# EAGLE design SensorRevB (EAGLE 9.2.2)
Assembly variants: A, B

## Sheet 1 of 4
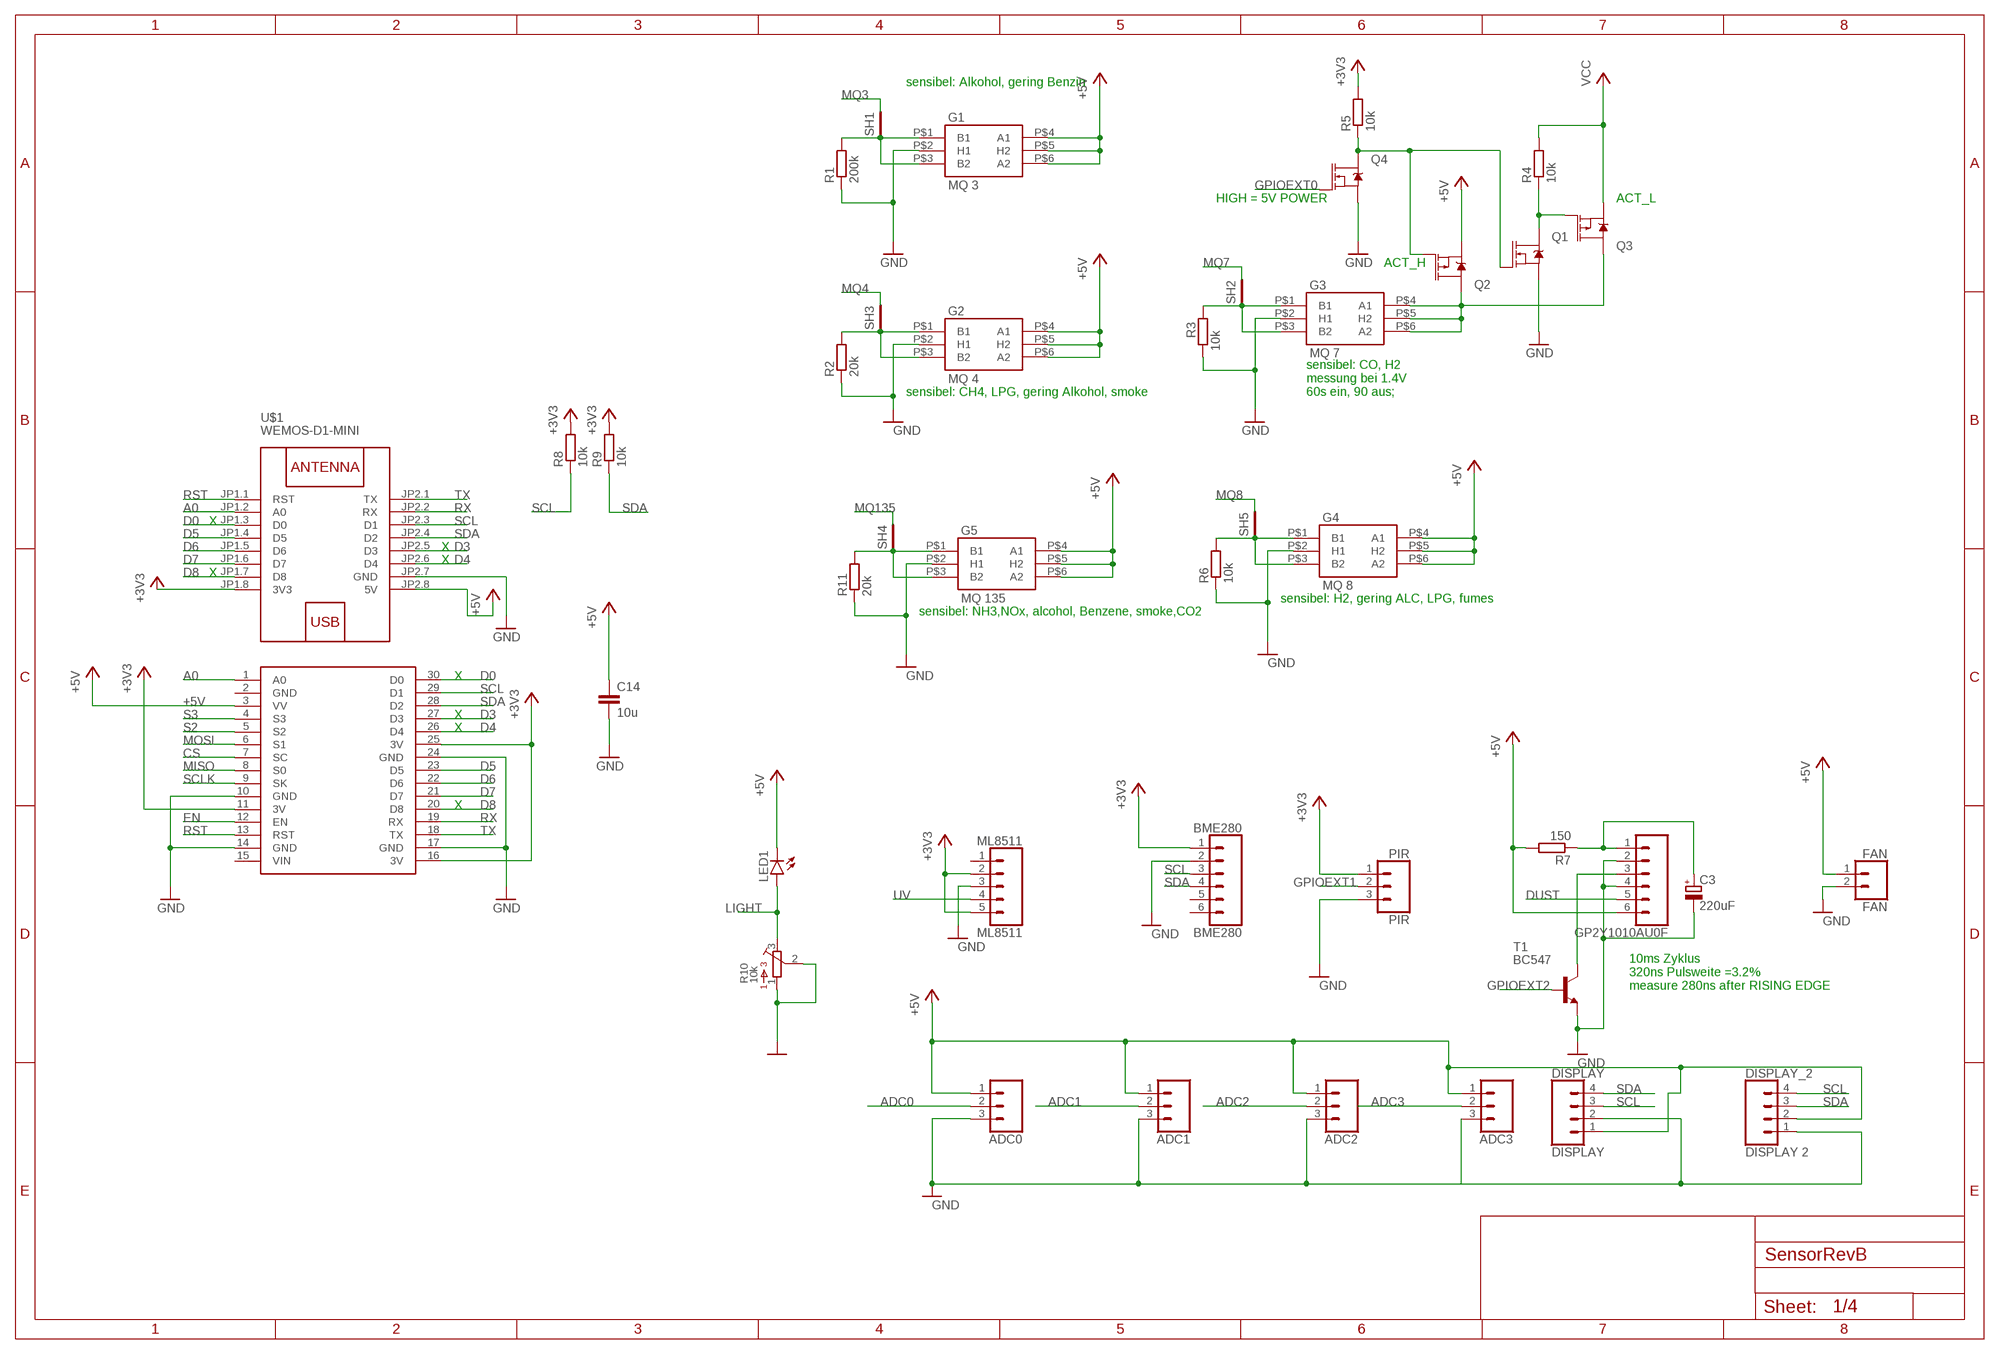
[diagram p0: schematic, sheet 1]

### Parts
ADC0  CONN_03  [1X03]
ADC1  CONN_03  [1X03]
ADC2  CONN_03  [1X03]
ADC3  CONN_03  [1X03]
BME280  BME280  CONN_06SILK_FEMALE_PTH  [1X06]
C3  220uF  CPOL-EUE2-5  [E2-5]
C14  10u  C-EUC0603  [C0603]
DISPLAY  DISPLAY  CONN_04  [1X04]
DISPLAY_2  DISPLAY 2  CONN_04  [1X04]
FAN  FAN  CONN_02LOCK  [1X02_LOCK]
G1  MQ 3  GAS_SOCKET  [GAS_SOCKET]
G2  MQ 4  GAS_SOCKET  [GAS_SOCKET]
G3  MQ 7  GAS_SOCKET  [GAS_SOCKET]
G4  MQ 8  GAS_SOCKET  [GAS_SOCKET]
G5  MQ 135  GAS_SOCKET  [GAS_SOCKET]
GP2Y1010AU0F  CONN_06SILK_FEMALE_PTH  [1X06]
LED1  LED5MM  [LED5MM]
ML8511  ML8511  CONN_05  [1X05]
PIR  PIR  CONN_03LOCK  [1X03_LOCK]
Q1  5.8A/30V/35mΩ  MOSFET-NCH-AO3404A  [SOT23-3]
Q2  4.3A/20V/54mΩ  MOSFET_PCH-IRLML2244  [SOT23-3]
Q3  4.3A/20V/54mΩ  MOSFET_PCH-IRLML2244  [SOT23-3]
Q4  5.8A/30V/35mΩ  MOSFET-NCH-AO3404A  [SOT23-3]
R1  200k  R-EU_R0805  [R0805]
R2  20k  R-EU_R0805  [R0805]
R3  10k  R-EU_R0805  [R0805]
R4  10k  R-EU_R0805  [R0805]
R5  10k  R-EU_R0805  [R0805]
R6  10k  R-EU_R0805  [R0805]
R7  150  R-EU_R0805  [R0805]
R8  10k  R-EU_R0805  [R0805]
R9  10k  R-EU_R0805  [R0805]
R10  10k  3362P  [3362P]
R11  20k  R-EU_R0805  [R0805]
SH1  SHORT-HT5  [SHORT_TOP-50]
SH2  SHORT-HT5  [SHORT_TOP-50]
SH3  SHORT-HT5  [SHORT_TOP-50]
SH4  SHORT-HT5  [SHORT_TOP-50]
SH5  SHORT-HT5  [SHORT_TOP-50]
T1  BC547  [TO92]
U$1  WEMOS-D1-MINI  [WEMOS-D1-MINI]
U$2  NODEMCU  [NODEMCU]  (not fitted in variant A)

### Nets
+3V3: BME280.1 ML8511.2 ML8511.5 PIR.1 R5.2 R8.2 R9.2 U$1.JP1.8(3V3) U$2.11(3V) U$2.16(3V) U$2.25(3V)
+5V [power]: ADC0.1 ADC1.1 ADC2.1 ADC3.1 C14.1 DISPLAY.1 DISPLAY_2.2 FAN.1 G1.P$4(A1) G1.P$5(H2) G1.P$6(A2) G2.P$4(A1) G2.P$5(H2) G2.P$6(A2) G4.P$4(A1) G4.P$5(H2) G4.P$6(A2) G5.P$4(A1) G5.P$5(H2) G5.P$6(A2) GP2Y1010AU0F.6 LED1.K(C) Q2.2(S) R7.2 U$1.JP2.8(5V) U$2.3(VV) ; also sheet 2,3
A0: U$1.JP1.2(A0) U$2.1(A0)
ADC0: ADC0.2 ; also sheet 2
ADC1: ADC1.2 ; also sheet 2
ADC2: ADC2.2 ; also sheet 2
ADC3: ADC3.2 ; also sheet 2
CS: U$2.7(SC)
D0: U$1.JP1.3(D0) U$2.30(D0)
D3: U$1.JP2.5(D3) U$2.27(D3)
D4: U$1.JP2.6(D4) U$2.26(D4)
D5: U$1.JP1.4(D5) U$2.23(D5) ; also sheet 2
D6: U$1.JP1.5(D6) U$2.22(D6)
D7: U$1.JP1.6(D7) U$2.21(D7)
D8: U$1.JP1.7(D8) U$2.20(D8)
DUST: GP2Y1010AU0F.5 ; also sheet 2
EN: U$2.12(EN)
GND [power]: ADC0.3 ADC1.3 ADC2.3 ADC3.3 BME280.2 C3.- C14.2 DISPLAY.2 DISPLAY_2.1 FAN.2 G1.P$2(H1) G2.P$2(H1) G3.P$2(H1) G4.P$2(H1) G5.P$2(H1) GP2Y1010AU0F.2 GP2Y1010AU0F.4 ML8511.3 PIR.3 Q1.2(S) Q4.2(S) R1.1 R2.1 R3.1 R6.1 R10.1 R10.2 R11.1 T1.1(E) U$1.JP2.7(GND) U$2.10(GND) U$2.14(GND) U$2.17(GND) U$2.24(GND) ; also sheet 2,3,4
GPIOEXT0: Q4.1(G) ; also sheet 2
GPIOEXT1: PIR.2 ; also sheet 2
GPIOEXT2: T1.2(B) ; also sheet 2
LIGHT: LED1.A R10.3 ; also sheet 2
MISO: U$2.8(S0)
MOSI: U$2.6(S1)
MQ3: SH1.2 ; also sheet 2
MQ4: SH3.2 ; also sheet 2
MQ7: SH2.2 ; also sheet 2
MQ8: SH5.2 ; also sheet 2
MQ135: SH4.2 ; also sheet 2
N$2: C3.+ GP2Y1010AU0F.1 R7.1
N$3: GP2Y1010AU0F.3 T1.3(C)
N$4: Q1.3(D) Q3.1(G) R4.1
N$5: Q1.1(G) Q2.1(G) Q4.3(D) R5.1
N$6 [power]: G1.P$1(B1) G1.P$3(B2) R1.2 SH1.1
N$12 [power]: G3.P$4(A1) G3.P$5(H2) G3.P$6(A2) Q2.3(D) Q3.3(D)
N$16 [power]: G3.P$1(B1) G3.P$3(B2) R3.2 SH2.1
N$17 [power]: G2.P$1(B1) G2.P$3(B2) R2.2 SH3.1
N$21 [power]: G5.P$1(B1) G5.P$3(B2) R11.2 SH4.1
N$22 [power]: G4.P$1(B1) G4.P$3(B2) R6.2 SH5.1
RST: U$1.JP1.1(RST) U$2.13(RST)
RX: U$1.JP2.2(RX) U$2.19(RX)
S2: U$2.5(S2)
S3: U$2.4(S3)
SCL: BME280.3 DISPLAY.3 DISPLAY_2.4 R8.1 U$1.JP2.3(D1) U$2.29(D1) ; also sheet 2
SCLK: U$2.9(SK)
SDA: BME280.4 DISPLAY.4 DISPLAY_2.3 R9.1 U$1.JP2.4(D2) U$2.28(D2) ; also sheet 2
TX: U$1.JP2.1(TX) U$2.18(TX)
UV: ML8511.4 ; also sheet 2
VCC [power]: Q3.2(S) R4.2 ; also sheet 3
Unconnected: BME280.5 BME280.6 ML8511.1 U$2.15(VIN)

### Notes on the sheet
- sensibel: Alkohol, gering Benzin
- HIGH = 5V POWER | ACT_L
- ACT_H
- sensibel: CH4, LPG, gering Alkohol, smoke
- sensibel: CO, H2
  messung bei 1.4V
  60s ein, 90 aus;
- X
- X
- X
- X
- sensibel: H2, gering ALC, LPG, fumes
- sensibel: NH3,NOx, alcohol, Benzene, smoke,CO2
- X
- X
- X
- X
- 10ms Zyklus
  320ns Pulsweite =3.2%
  measure 280ns after RISING EDGE

## Sheet 2 of 4: PORTEXP MUX ADC
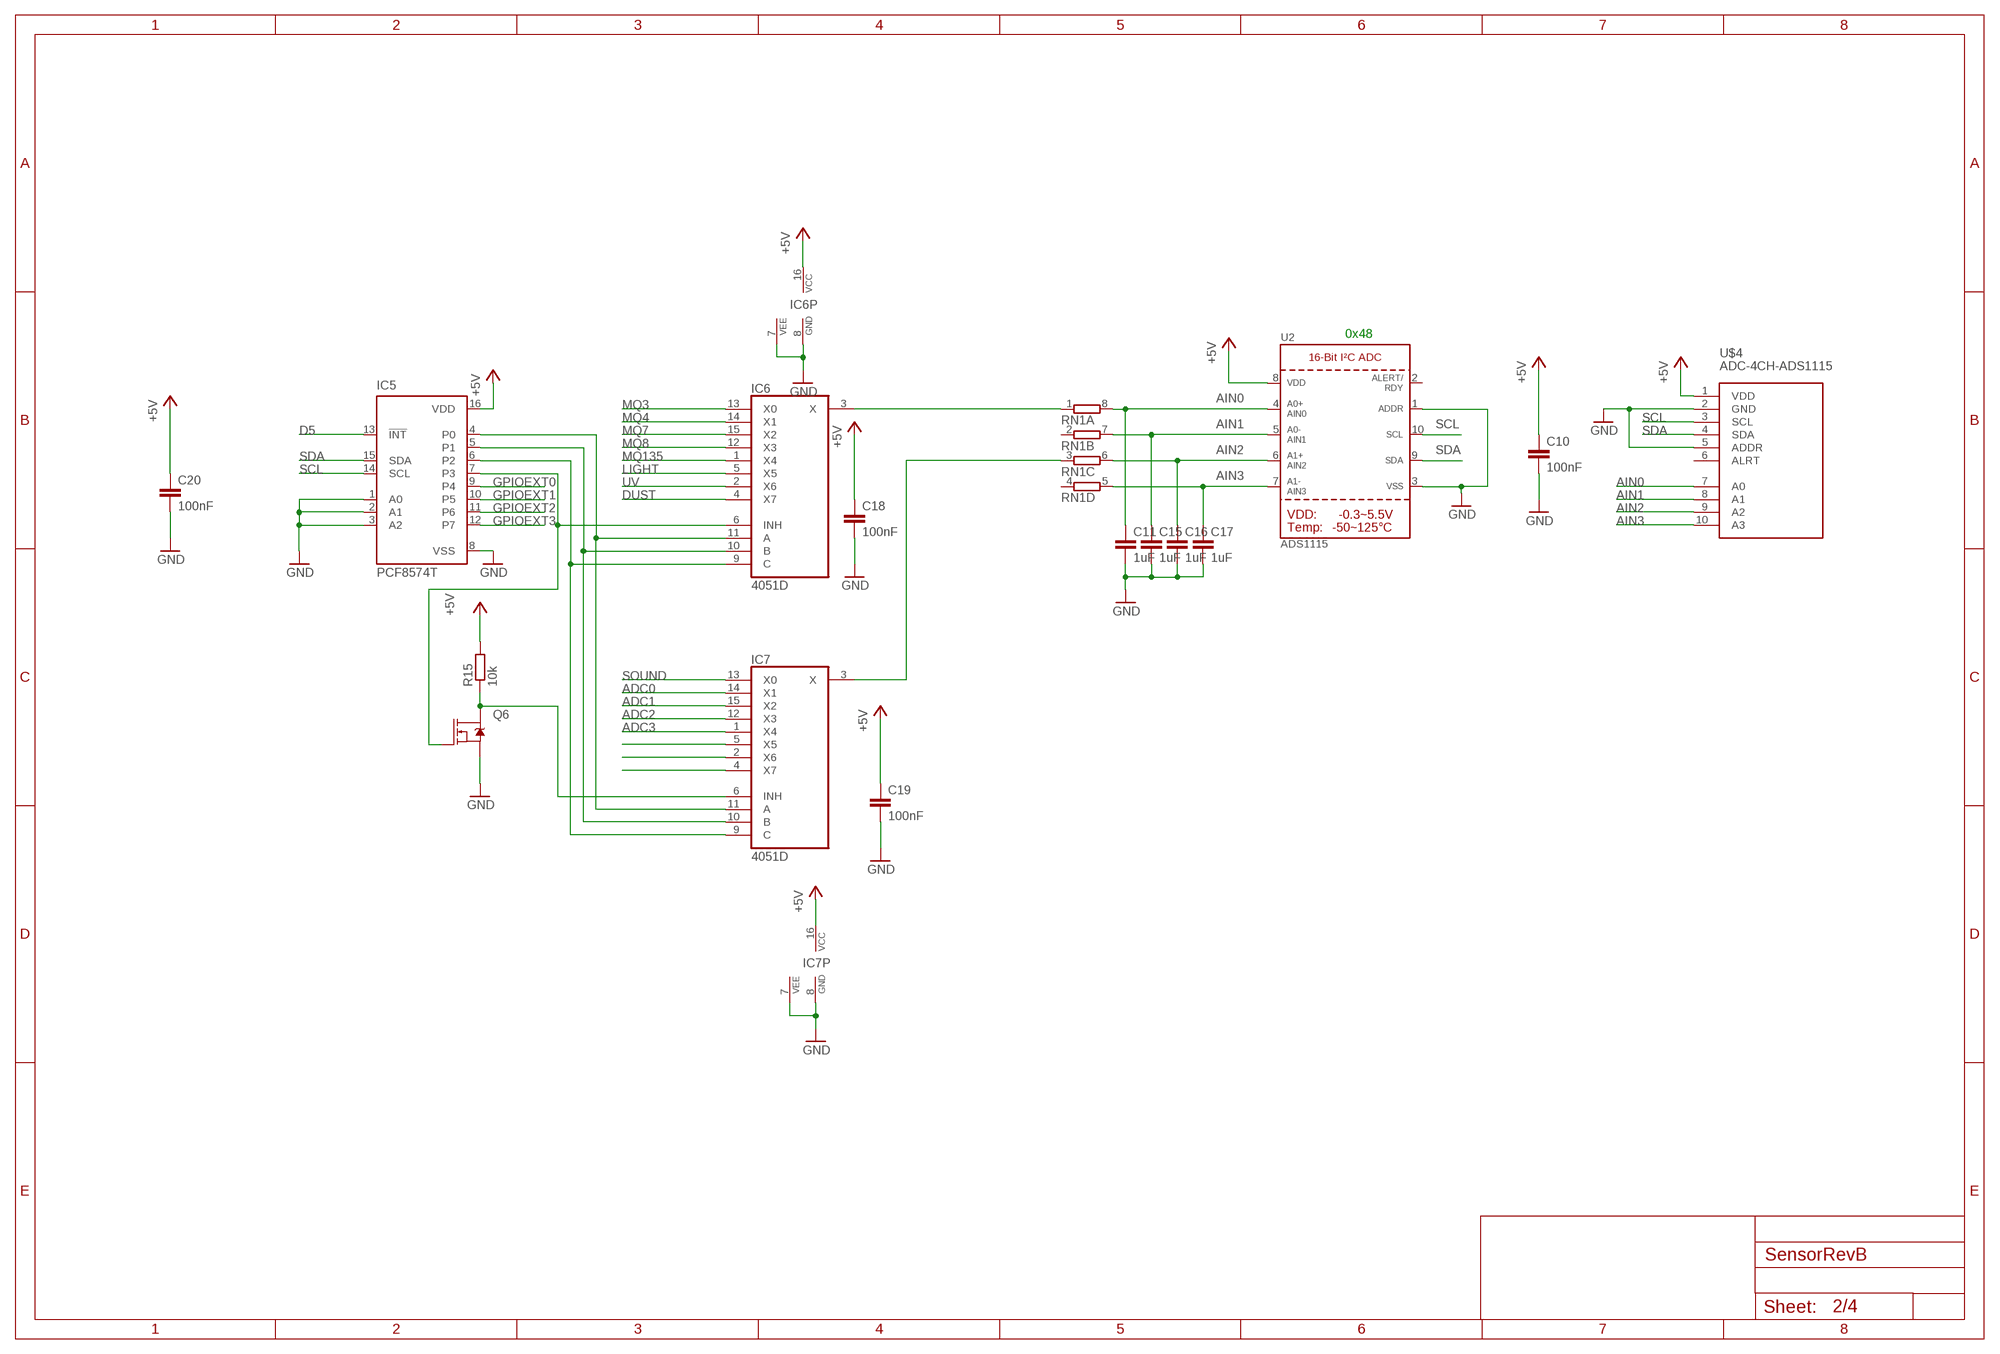
[diagram p1: schematic, sheet 2]

### Parts
C10  100nF  C-EUC0603  [C0603]
C11  1uF  C-EUC0603  [C0603]
C15  1uF  C-EUC0603  [C0603]
C16  1uF  C-EUC0603  [C0603]
C17  1uF  C-EUC0603  [C0603]
C18  100nF  C-EUC0603  [C0603]
C19  100nF  C-EUC0603  [C0603]
C20  100nF  C-EUC0603  [C0603]
IC5  PCF8574T  [SO16W]
IC6  4051D  [SO16]
IC7  4051D  [SO16]
Q6  5.8A/30V/35mΩ  MOSFET-NCH-AO3404A  [SOT23-3]
R15  10k  R-EU_R0805  [R0805]
RN1  4R-N0603-ARC  [0603-ARC]
U2  ADS1115  [MSOP10]
U$4  ADC-4CH-ADS1115  [ADC-4CH-ADS1115]  (not fitted in variant A)

### Nets
+5V [power]: C10.1 C18.1 C19.1 C20.1 IC5.16(VDD) IC6.16(VCC) IC7.16(VCC) R15.2 U2.8(VDD) U$4.1(VDD) ; also sheet 1,3
ADC0: IC7.14(X1) ; also sheet 1
ADC1: IC7.15(X2) ; also sheet 1
ADC2: IC7.12(X3) ; also sheet 1
ADC3: IC7.1(X4) ; also sheet 1
AIN0: C11.1 RN1.8 U2.4(AIN0) U$4.7(A0)
AIN1: C15.1 RN1.7 U2.5(AIN1) U$4.8(A1)
AIN2: C16.1 RN1.6 U2.6(AIN2) U$4.9(A2)
AIN3: C17.1 RN1.5 U2.7(AIN3) U$4.10(A3)
D5: IC5.13(!INT) ; also sheet 1
DUST: IC6.4(X7) ; also sheet 1
GND [power]: C10.2 C11.2 C15.2 C16.2 C17.2 C18.2 C19.2 C20.2 IC5.1(A0) IC5.2(A1) IC5.3(A2) IC5.8(VSS) IC6.7(VEE) IC6.8(GND) IC7.7(VEE) IC7.8(GND) Q6.2(S) U2.1(ADDR) U2.3(VSS) U$4.2(GND) U$4.5(ADDR) ; also sheet 1,3,4
GPIOEXT0: IC5.9(P4) ; also sheet 1
GPIOEXT1: IC5.10(P5) ; also sheet 1
GPIOEXT2: IC5.11(P6) ; also sheet 1
GPIOEXT3: IC5.12(P7)
LIGHT: IC6.5(X5) ; also sheet 1
MQ3: IC6.13(X0) ; also sheet 1
MQ4: IC6.14(X1) ; also sheet 1
MQ7: IC6.15(X2) ; also sheet 1
MQ8: IC6.12(X3) ; also sheet 1
MQ135: IC6.1(X4) ; also sheet 1
N$18: IC5.4(P0) IC6.11(A) IC7.11(A)
N$19: IC5.5(P1) IC6.10(B) IC7.10(B)
N$20: IC5.6(P2) IC6.9(C) IC7.9(C)
N$32: IC5.7(P3) IC6.6(INH) Q6.1(G)
N$33: IC7.6(INH) Q6.3(D) R15.1
N$34: IC6.3(X) RN1.1
N$35: IC7.3(X) RN1.3
N$44: IC7.5(X5)
N$45: IC7.2(X6)
N$46: IC7.4(X7)
SCL: IC5.14(SCL) U2.10(SCL) U$4.3(SCL) ; also sheet 1
SDA: IC5.15(SDA) U2.9(SDA) U$4.4(SDA) ; also sheet 1
SOUND: IC7.13(X0) ; also sheet 4
UV: IC6.2(X6) ; also sheet 1
Unconnected: RN1.2 RN1.4 U2.2(ALERT/RDY) U$4.6(ALRT)

### Notes on the sheet
- 0x48

## Sheet 3 of 4: Voltage Regulation
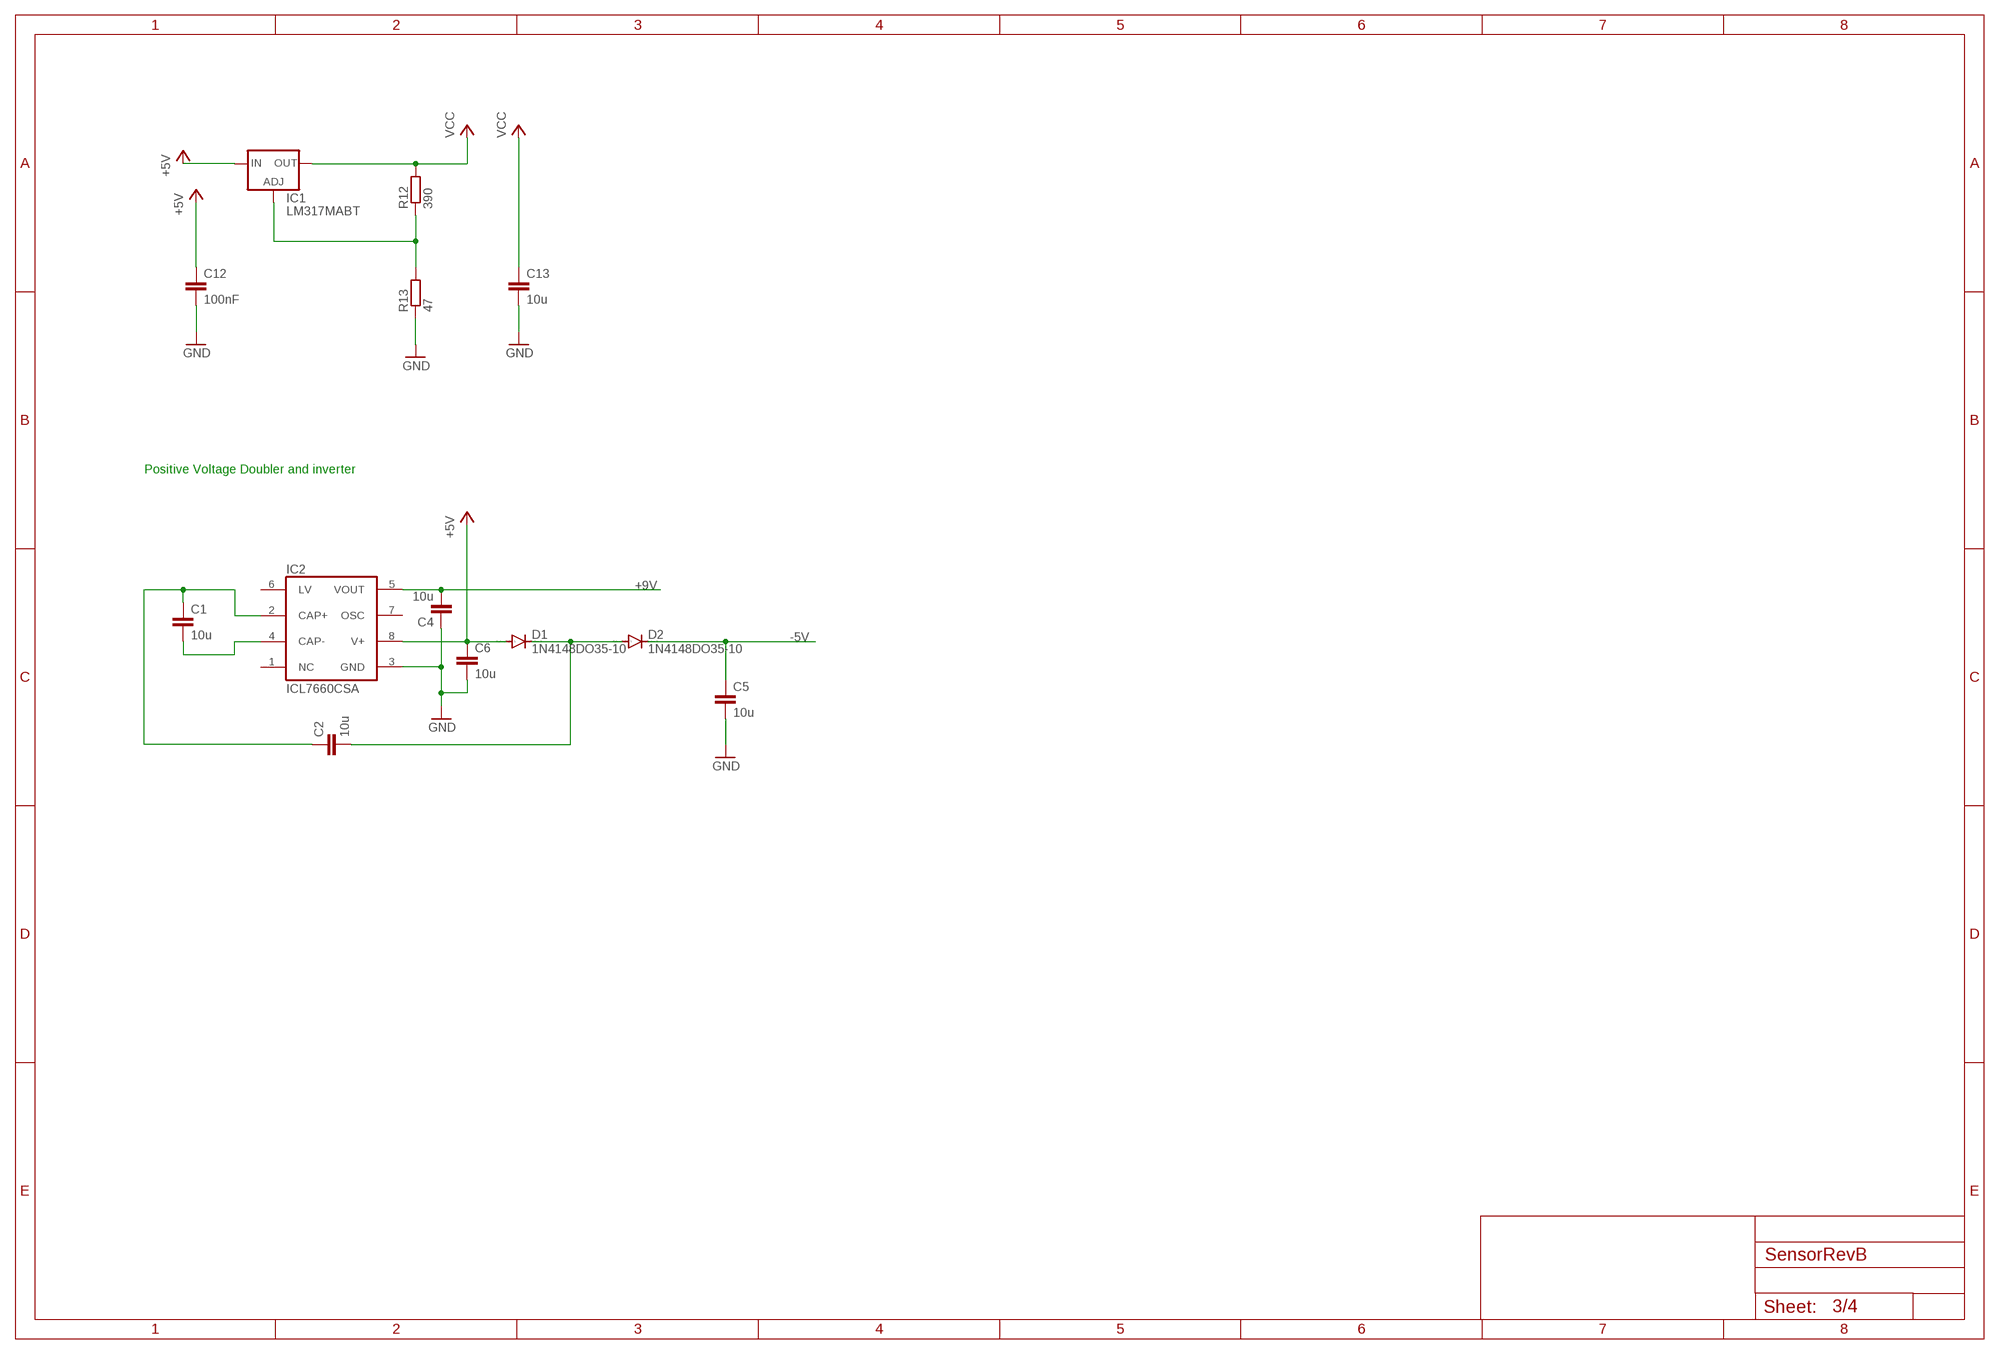
[diagram p2: schematic, sheet 3]

### Parts
C1  10u  C-EUC0603  [C0603]
C2  10u  C-EUC0603  [C0603]
C4  10u  C-EUC0603  [C0603]
C5  10u  C-EUC0603  [C0603]
C6  10u  C-EUC0603  [C0603]
C12  100nF  C-EUC0603  [C0603]
C13  10u  C-EUC0603  [C0603]
D1  1N4148DO35-10  [DO35-10]
D2  1N4148DO35-10  [DO35-10]
IC1  LM317MABT  [TO220L1]
IC2  ICL7660CSA  [SO08]
R12  390  R-EU_R0805  [R0805]
R13  47  R-EU_R0805  [R0805]

### Nets
+5V [power]: C6.1 C12.1 D1.A IC1.3(IN) IC2.8(V+) ; also sheet 1,2
+9V: C4.2 IC2.5(VOUT) ; also sheet 4
-5V: C5.1 D2.C ; also sheet 4
GND [power]: C4.1 C5.2 C6.2 C12.2 C13.2 IC2.3(GND) R13.1 ; also sheet 1,2,4
N$1: C1.1 C2.1 IC2.2(CAP+)
N$7: C1.2 IC2.4(CAP-)
N$9: IC1.1(ADJ) R12.1 R13.2
N$10: C2.2 D1.C D2.A
VCC [power]: C13.1 IC1.2(OUT) R12.2 ; also sheet 1
Unconnected: IC2.1(NC) IC2.6(LV) IC2.7(OSC)

### Notes on the sheet
- Positive Voltage Doubler and inverter

## Sheet 4 of 4
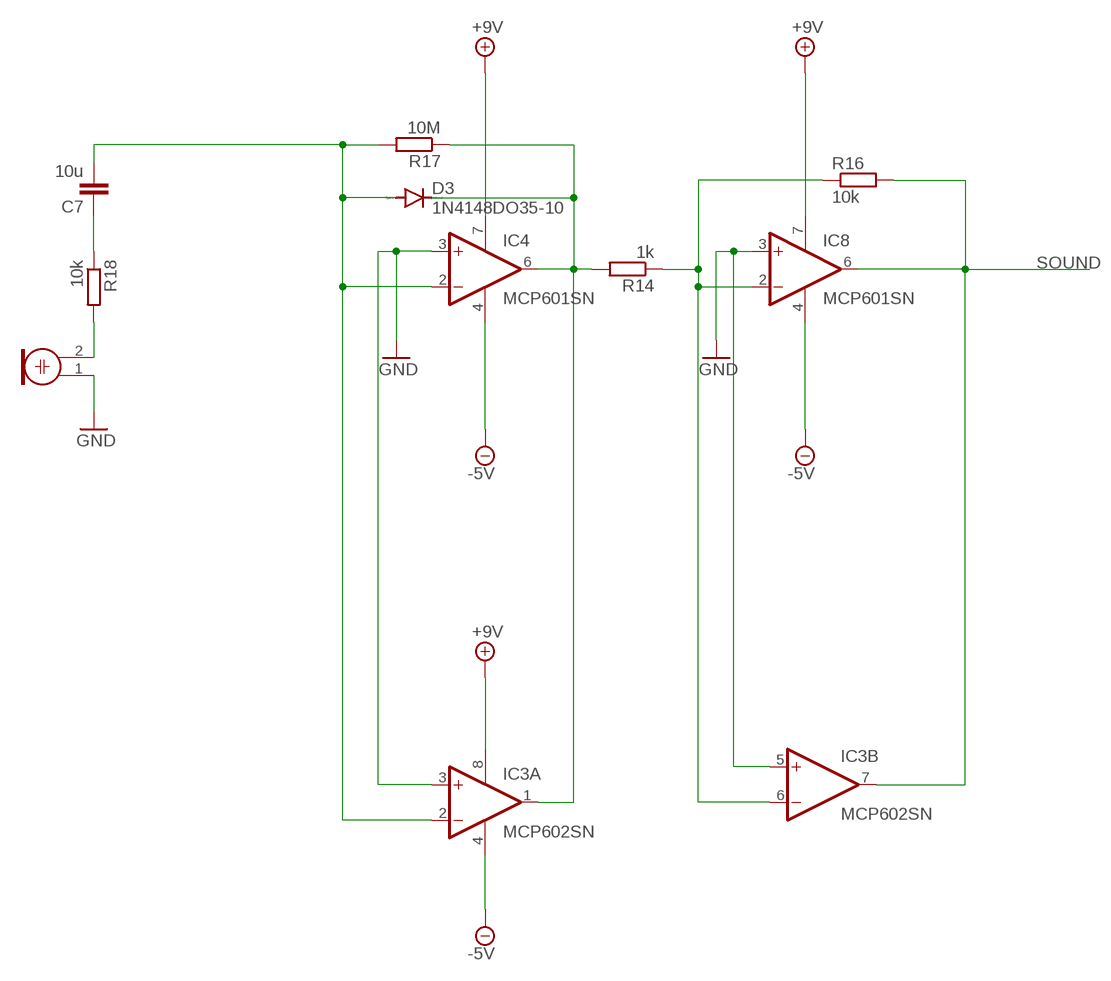
[diagram p3: schematic, sheet 4]

### Parts
C7  10u  C-EUC0603  [C0603]
D3  1N4148DO35-10  [DO35-10]
IC3  MCP602SN  [SO08]  (not fitted in variant A)
IC4  MCP601SN  [SO08]
IC8  MCP601SN  [SO08]
M1  ELECTRET_MICROPHON-WM-61B  [WM-61B]
R14  1k  R-EU_R0805  [R0805]
R16  10k  R-EU_R0805  [R0805]
R17  10M  R-EU_R0805  [R0805]
R18  10k  R-EU_R0805  [R0805]

### Nets
+9V: IC3.8(P:V+) IC4.7(V+) IC8.7(V+) ; also sheet 3
-5V: IC3.4(P:V-) IC4.4(V-) IC8.4(V-) ; also sheet 3
GND [power]: IC3.3(A:+IN) IC3.5(B:+IN) IC4.3(+IN) IC8.3(+IN) M1.1 ; also sheet 1,2,3
N$8: IC3.6(B:-IN) IC8.2(-IN) R14.1 R16.1
N$11: D3.C IC3.1(A:OUT) IC4.6(OUT) R14.2 R17.1
N$13: C7.1 R18.1
N$14: C7.2 D3.A IC3.2(A:-IN) IC4.2(-IN) R17.2
N$15: M1.2 R18.2
SOUND: IC3.7(B:OUT) IC8.6(OUT) R16.2 ; also sheet 2

## Power pins joined to a net without a drawn wire
GND: U$2.2(GND)

## Library data of the parts
ADC0 ADC1-ADC3 PIR = SparkFun-Connectors:CONN_03: Multi connection point. Often used as Generic Header-pin footprint for 0.1 inch spaced/style header connections On any of the 0.1 inch spaced packages, you can populate with these: Break Away Headers - Straight <https://www.sparkfun.com/products/116> (PRT-00116) Break Away Male Headers - Right Angle <https://www.sparkfun.com/products/553> (PRT-00553) Female Headers <https://www.sparkfun.com/products/115> (PRT-00115) Break Away Headers - Machine Pin <https://www.sparkfun.com/products/117> (PRT-00117) Break Away Female Headers - Swiss Machine Pin <https://www.sparkfun.com/products/743> (PRT-00743) Stackable Header - 3 Pin (Female, 0.1") <https://www.sparkfun.com/products/13875> (PRT-13875) For SCREWTERMINALS and SPRING TERMINALS visit here: Screw Terimnals on SparkFun.com <https://www.sparkfun.com/search/results?term=Screw+Terminals> (5mm/3.5mm/2.54mm spacing) This device is also useful as a general connection point to wire up your design to another part of your project. Our various solder wires solder well into these plated through hole pads. Hook-Up Wire - Assortment (Stranded, 22 AWG) <https://www.sparkfun.com/products/11375> (PRT-11375) Hook-Up Wire - Assortment (Solid Core, 22 AWG) <https://www.sparkfun.com/products/11367> (PRT-11367) View the entire wire category on our website here <https://www.sparkfun.com/categories/141> Special notes: Molex polarized connector foot print use with SKU : PRT-08232 with associated crimp pins and housings.
BME280 GP2Y1010AU0F = SparkFun-Connectors:CONN_06: Multi connection point. Often used as Generic Header-pin footprint for 0.1 inch spaced/style header connections On any of the 0.1 inch spaced packages, you can populate with these: Break Away Headers - Straight <https://www.sparkfun.com/products/116> (PRT-00116) Break Away Male Headers - Right Angle <https://www.sparkfun.com/products/553> (PRT-00553) Female Headers <https://www.sparkfun.com/products/115> (PRT-00115) Break Away Headers - Machine Pin <https://www.sparkfun.com/products/117> (PRT-00117) Break Away Female Headers - Swiss Machine Pin <https://www.sparkfun.com/products/743> (PRT-00743) Arduino Stackable Header - 6 Pin <https://www.sparkfun.com/products/9280> (PRT-09280) For SCREWTERMINALS and SPRING TERMINALS visit here: Screw Terimnals on SparkFun.com <https://www.sparkfun.com/search/results?term=Screw+Terminals> (5mm/3.5mm/2.54mm spacing) This device is also useful as a general connection point to wire up your design to another part of your project. Our various solder wires solder well into these plated through hole pads. Hook-Up Wire - Assortment (Stranded, 22 AWG) <https://www.sparkfun.com/products/11375> (PRT-11375) Hook-Up Wire - Assortment (Solid Core, 22 AWG) <https://www.sparkfun.com/products/11367> (PRT-11367) View the entire wire category on our website here <https://www.sparkfun.com/categories/141>; PROD_ID: CONN-08437
C1 C2 C4-C7 C10-C20 = rcl:C-EU: CAPACITOR, European symbol; SPICEPREFIX: C
C3 = rcl:CPOL-EU: POLARIZED CAPACITOR, European symbol; SPICEPREFIX: C
D1-D3 = diode:1N4148: DIODE high speed (Philips)
DISPLAY DISPLAY_2 = SparkFun-Connectors:CONN_04: Multi connection point. Often used as Generic Header-pin footprint for 0.1 inch spaced/style header connections On any of the 0.1 inch spaced packages, you can populate with these: Break Away Headers - Straight <https://www.sparkfun.com/products/116> (PRT-00116) Break Away Male Headers - Right Angle <https://www.sparkfun.com/products/553> (PRT-00553) Female Headers <https://www.sparkfun.com/products/115> (PRT-00115) Break Away Headers - Machine Pin <https://www.sparkfun.com/products/117> (PRT-00117) Break Away Female Headers - Swiss Machine Pin <https://www.sparkfun.com/products/743> (PRT-00743) For SCREWTERMINALS and SPRING TERMINALS visit here: Screw Terimnals on SparkFun.com <https://www.sparkfun.com/search/results?term=Screw+Terminals> (5mm/3.5mm/2.54mm spacing) This device is also useful as a general connection point to wire up your design to another part of your project. Our various solder wires solder well into these plated through hole pads. Hook-Up Wire - Assortment (Stranded, 22 AWG) <https://www.sparkfun.com/products/11375> (PRT-11375) Hook-Up Wire - Assortment (Solid Core, 22 AWG) <https://www.sparkfun.com/products/11367> (PRT-11367) View the entire wire category on our website here <https://www.sparkfun.com/categories/141> Special notes: Molex polarized connector foot print use with SKU : PRT-08231 with associated crimp pins and housings. 1MM SMD Version SKU: PRT-10208; PROD_ID: CONN-09696
FAN = SparkFun-Connectors:CONN_02: Multi connection point. Often used as Generic Header-pin footprint for 0.1 inch spaced/style header connections On any of the 0.1 inch spaced packages, you can populate with these: Break Away Headers - Straight <https://www.sparkfun.com/products/116> (PRT-00116) Break Away Male Headers - Right Angle <https://www.sparkfun.com/products/553> (PRT-00553) Female Headers <https://www.sparkfun.com/products/115> (PRT-00115) Break Away Headers - Machine Pin <https://www.sparkfun.com/products/117> (PRT-00117) Break Away Female Headers - Swiss Machine Pin <https://www.sparkfun.com/products/743> (PRT-00743) For SCREWTERMINALS and SPRING TERMINALS visit here: Screw Terimnals on SparkFun.com <https://www.sparkfun.com/search/results?term=Screw+Terminals> (5mm/3.5mm/2.54mm spacing) This device is also useful as a general connection point to wire up your design to another part of your project. Our various solder wires solder well into these plated through hole pads. Hook-Up Wire - Assortment (Stranded, 22 AWG) <https://www.sparkfun.com/products/11375> (PRT-11375) Hook-Up Wire - Assortment (Solid Core, 22 AWG) <https://www.sparkfun.com/products/11367> (PRT-11367) View the entire wire category on our website here <https://www.sparkfun.com/categories/141> Special notes: Molex polarized connector foot print use with: PRT-08233 with associated crimp pins and housings. 2.54_SCREWTERM for use with PRT-10571. 3.5mm Screw Terminal footprints for PRT-08084 5mm Screw Terminal footprints for use with PRT-08432
G1-G5 = custom:GAS_SOCKET
IC1 = v-reg:LM317?*: 500 mA Adjustable Output Positive Voltage Regulator Source: http://www.onsemi.co.jp .. LM317M-D.PDF
IC2 = maxim:ICL7660CSA: VOLTAGE CONVERTER; MF: MAXIM; MPN: ICL7660CSA; OC_FARNELL: 9724710; OC_NEWARK: 34C3732
IC3 = linear:MCP602: Single Op Amp 2.7V to 6.0V Single Supply CMOS Source: http://ww1.microchip.com/downloads/en/DeviceDoc/21314g.pdf
IC4 IC8 = linear:MCP601: Single Op Amp 2.7V to 6.0V Single Supply CMOS Source: http://ww1.microchip.com/downloads/en/DeviceDoc/21314g.pdf
IC5 = micro-philips:PCF8574: I2C-Bus Remote 8-bit I/O expander http://www.semiconductors.philips.com/acrobat_download/datasheets/PCF8574_4.pdf; MPN: PCF8574T/3,512; OC_FARNELL: 1201255; OC_NEWARK: 70R6870
IC6 IC7 = 40xx:4051: 8-channel ANALOG MULTIPLEXER
LED1 = led:LED: LED OSRAM: - CHIPLED LG R971, LG N971, LY N971, LG Q971, LY Q971, LO R971, LY R971 LH N974, LH R974 LS Q976, LO Q976, LY Q976 LO Q996 - Hyper CHIPLED LW Q18S LB Q993, LB Q99A, LB R99A - SideLED LS A670, LO A670, LY A670, LG A670, LP A670 LB A673, LV A673, LT A673, LW A673 LH A674 LY A675 LS A676, LA A676, LO A676, LY A676, LW A676 LS A679, LY A679, LG A679 - Hyper Micro SIDELED® LS Y876, LA Y876, LO Y876, LY Y876 LT Y87S - SmartLED LW L88C, LW L88S LB L89C, LB L89S, LG L890 LS L89K, LO L89K, LY L89K LS L896, LA L896, LO L896, LY L896 - TOPLED LS T670, LO T670, LY T670, LG T670, LP T670 LSG T670, LSP T670, LSY T670, LOP T670, LYG T670 LG T671, LOG T671, LSG T671 LB T673, LV T673, LT T673, LW T673 LH T674 LS T676, LA T676, LO T676, LY T676, LB T676, LH T676, LSB T676, LW T676 LB T67C, LV T67C, LT T67C, LS T67K, LO T67K, LY T67K, LW E67C LS E67B, LA E67B, LO E67B, LY E67B, LB E67C, LV E67C, LT E67C LW T67C LS T679, LY T679, LG T679 LS T770, LO T770, LY T770, LG T770, LP T770 LB T773, LV T773, LT T773, LW T773 LH T774 LS E675, LA E675, LY E675, LS T675 LS T776, LA T776, LO T776, LY T776, LB T776 LHGB T686 LT T68C, LB T68C - Hyper Mini TOPLED® LB M676 - Mini TOPLED Santana® LG M470 LS M47K, LO M47K, LY M47K Source: http://www.osram.convergy.de LUXEON: - LUMILED® LXK2-PW12-R00, LXK2-PW12-S00, LXK2-PW14-U00, LXK2-PW14-V00 LXK2-PM12-R00, LXK2-PM12-S00, LXK2-PM14-U00 LXK2-PE12-Q00, LXK2-PE12-R00, LXK2-PE12-S00, LXK2-PE14-T00, LXK2-PE14-U00 LXK2-PB12-K00, LXK2-PB12-L00, LXK2-PB12-M00, LXK2-PB14-N00, LXK2-PB14-P00, LXK2-PB14-Q00 LXK2-PR12-L00, LXK2-PR12-M00, LXK2-PR14-Q00, LXK2-PR14-R00 LXK2-PD12-Q00, LXK2-PD12-R00, LXK2-PD12-S00 LXK2-PH12-R00, LXK2-PH12-S00 LXK2-PL12-P00, LXK2-PL12-Q00, LXK2-PL12-R00 Source: www.luxeon.com KINGBRIGHT: KA-3528ASYC Source: www.kingbright.com
M1 = microphon:ELECTRET_MICROPHON-: Electret Condenser Microphone
ML8511 = SparkFun-Connectors:CONN_05: Multi connection point. Often used as Generic Header-pin footprint for 0.1 inch spaced/style header connections On any of the 0.1 inch spaced packages, you can populate with these: Break Away Headers - Straight <https://www.sparkfun.com/products/116> (PRT-00116) Break Away Male Headers - Right Angle <https://www.sparkfun.com/products/553> (PRT-00553) Female Headers <https://www.sparkfun.com/products/115> (PRT-00115) Break Away Headers - Machine Pin <https://www.sparkfun.com/products/117> (PRT-00117) Break Away Female Headers - Swiss Machine Pin <https://www.sparkfun.com/products/743> (PRT-00743) For SCREWTERMINALS and SPRING TERMINALS visit here: Screw Terimnals on SparkFun.com <https://www.sparkfun.com/search/results?term=Screw+Terminals> (5mm/3.5mm/2.54mm spacing) This device is also useful as a general connection point to wire up your design to another part of your project. Our various solder wires solder well into these plated through hole pads. Hook-Up Wire - Assortment (Stranded, 22 AWG) <https://www.sparkfun.com/products/11375> (PRT-11375) Hook-Up Wire - Assortment (Solid Core, 22 AWG) <https://www.sparkfun.com/products/11367> (PRT-11367) View the entire wire category on our website here <https://www.sparkfun.com/categories/141> Special notes: Molex polarized connector foot print use with SKU : PRT-08231 with associated crimp pins and housings. 1MM SMD Version SKU: PRT-10208
Q1 Q4 Q6 = SparkFun-DiscreteSemi:MOSFET-NCH: N-channel MOSFETs Voltage controlled devices that allow control of high current outputs. SparkFun Products: SparkFun OpenScale <https://www.sparkfun.com/products/13261> SparkFun Digital Sandbox <https://www.sparkfun.com/products/12651> SparkFun Monster Moto Shield <https://www.sparkfun.com/products/10182> SparkFun MOSFET Power Controller <https://www.sparkfun.com/products/11214>; PROD_ID: TRANS-12988
Q2 Q3 = SparkFun-DiscreteSemi:MOSFET_PCH: P-channel MOSFETs Voltage controlled devices that allow control of high current outputs. SparkFun Products: SparkFun ESP32 Thing <https://www.sparkfun.com/products/13907> SparkFun ESP8266 Thing <https://www.sparkfun.com/products/13231>; PROD_ID: TRANS-11153
R1-R9 R11-R18 = rcl:R-EU_: RESISTOR, European symbol; SPICEPREFIX: R
R10 = bourns:3362: 3362 Series 1/4" Square Trimmer
RN1 = resistor-dil:4R-N: Array Chip Resistor Source: RS Component / Phycomp; OC_FARNELL: unknown; OC_NEWARK: unknown
SH1-SH5 = shorts-old:SHORT-H: Short between two nets; BOM: no
T1 = transistor:BC547: NPN TRANSISTOR
U2 = ADS1115:ADS1115: 16-Bit Del-Sig ADC Four single-ended inputs or two differential inputs Internal PGA I2C interface 2.0-5.5V; AVAILABILITY: Unavailable; DESCRIPTION: 16-Bit ADC with Integrated MUX PGA Comparator Oscillator and Reference; MF: Texas Instruments; MP: ADS1115; PACKAGE: XFQFN-10 Texas Instruments; PRICE: None
U$1 = diy-modules:WEMOS-D1-MINI: WEMOS D1 mini: Mini Wi-Fi Board based on ESP-8266 device More details can be found here: https://www.wemos.cc/product/d1-mini.html Click here to find device on ebay.com <http://www.ebay.com/sch/wemos+d1+mini+nodemcu>
U$2 = nodemcu:NODEMCU
U$4 = diy-modules:ADC-4CH-ADS1115: 4 Channel 16-Bit Analog-to-Digital Converter based on ADS1115 chip Arduino ADS1115 Getting Started Tutorial is available here: http://henrysbench.capnfatz.com/henrys-bench/arduino-voltage-measurements/arduino-ads1115-module-getting-started-tutorial/ ADS1115 datasheet is available here: http://www.ti.com/lit/ds/symlink/ads1115.pdf Click here to find device on ebay.com <http://www.ebay.com/sch/ads1115+module>

## Net classes
0 default: width 0.127 mm, drill 0.2 mm, clearance 0.127 mm
1 power: width 0.203 mm, drill 0.381 mm, clearance 0.203 mm

## Board
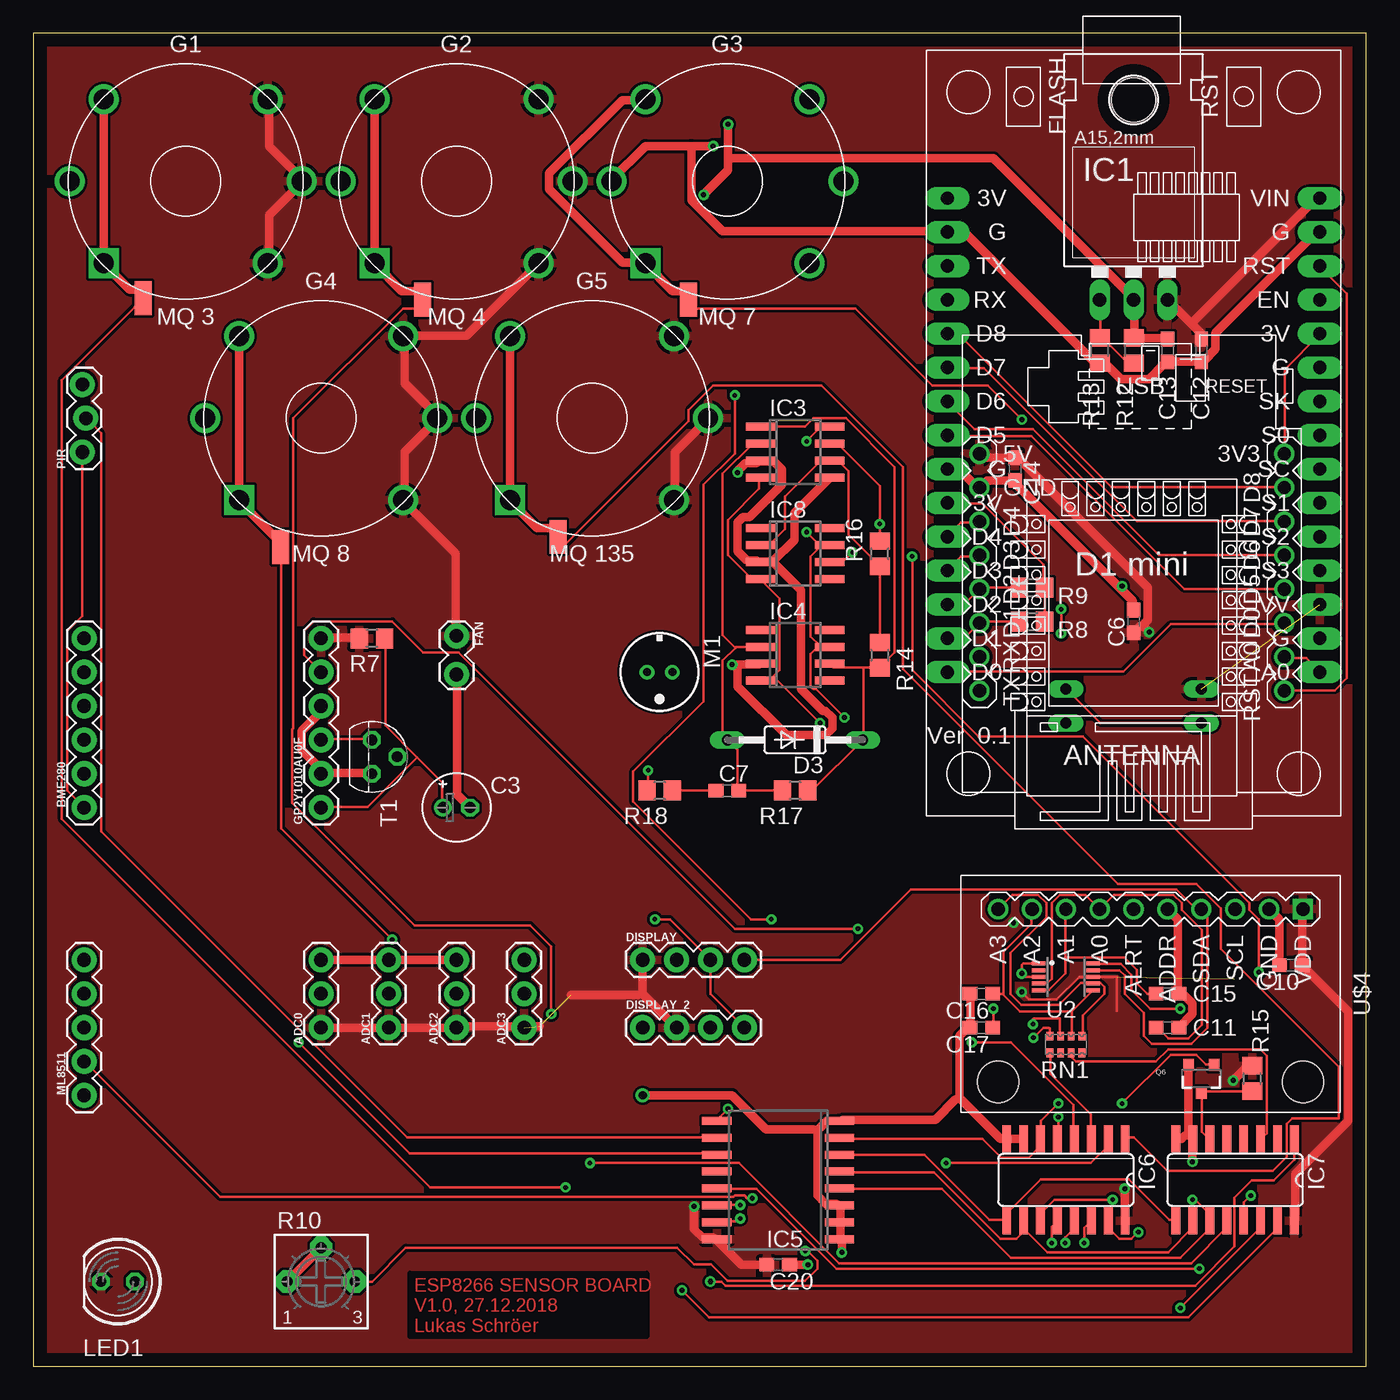
[diagram p4: board, top side]
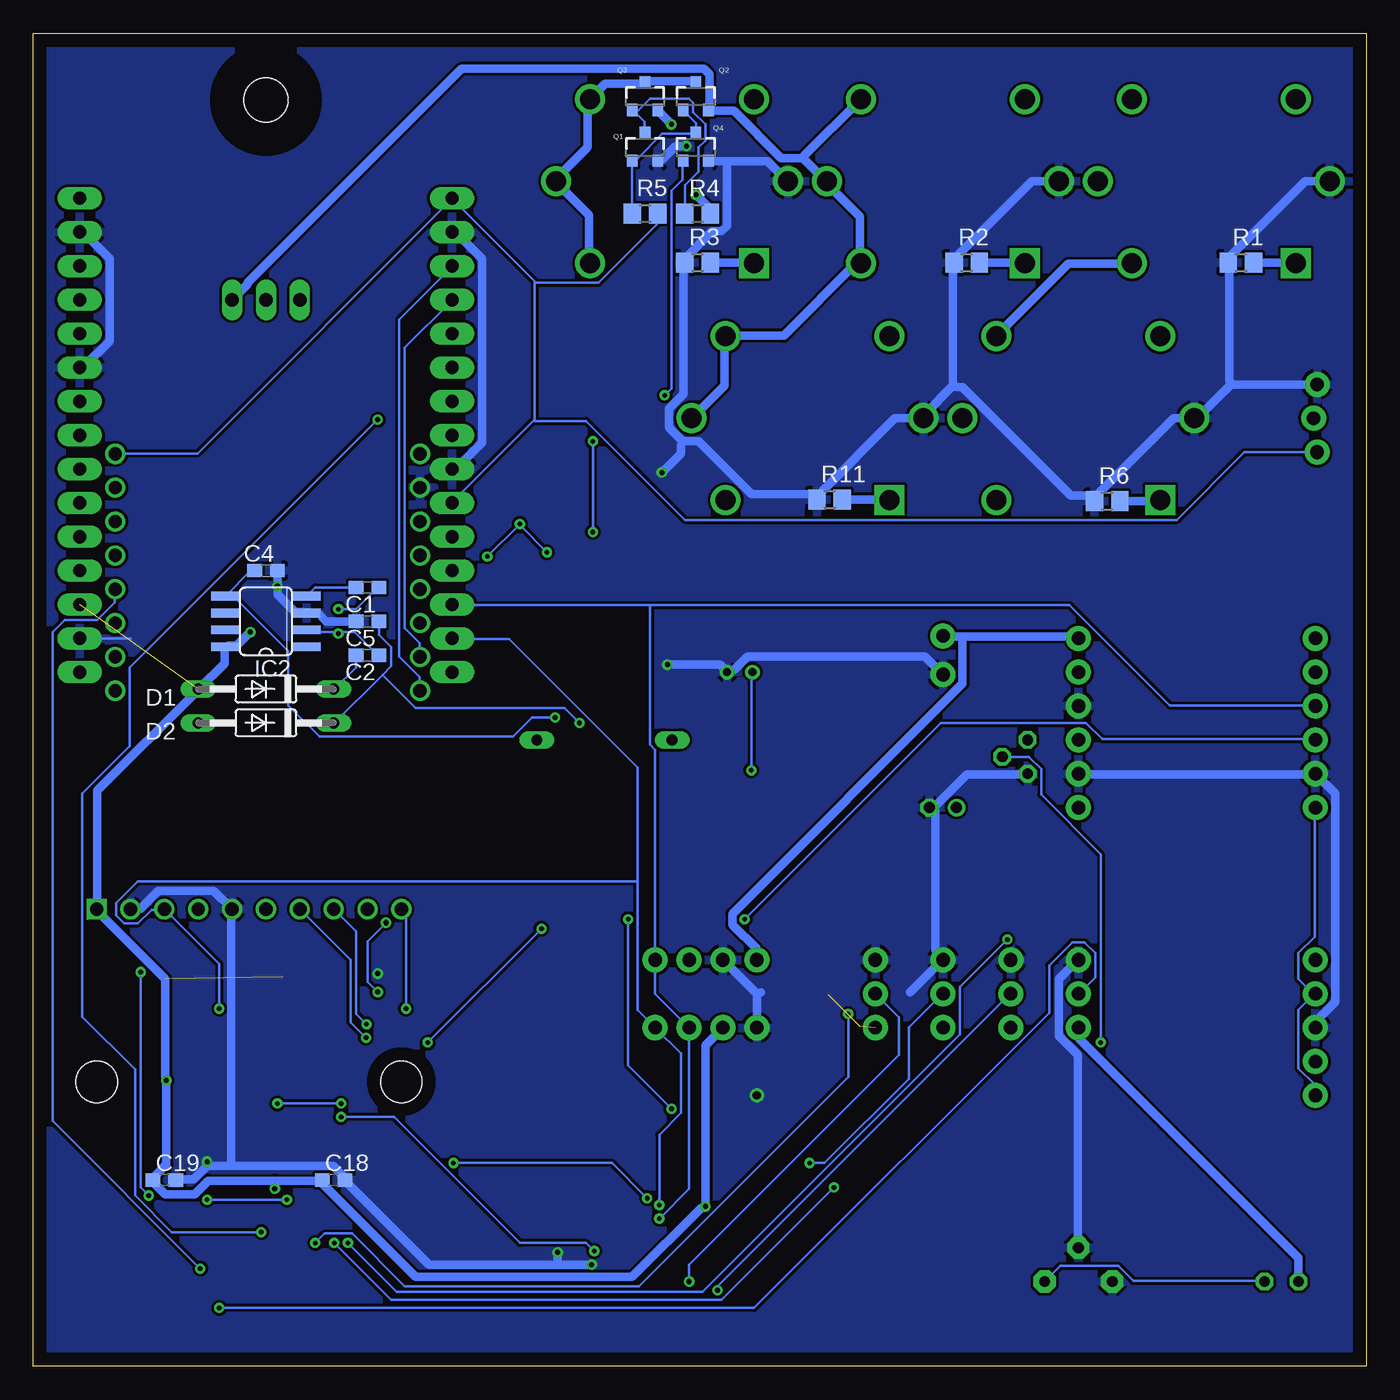
[diagram p5: board, bottom side, seen from below]

Size 100 x 100 mm. Coordinates in mm from the lower left corner, seen from the top.
Outline: 0,0 100,0 100,100 0,100 0,0
Copper layers (1*16): Top 0.035mm / dielectric 1.5mm / Bottom 0.035mm
Design rules "default *": minimum track width 6mil, minimum drill 0.35mm, track to track 6mil, track to pad 6mil, pad to pad 6mil, via to via 8mil, smd to smd 6mil, copper to edge 40mil, drill to drill 6mil, minimum pad ring 10mil, minimum via ring 8mil, stop-mask expansion 4mil, vias tented up to drill 0mil, thermal gap 10mil

### Footprints (pad centres in the part's own frame; a part is rotated, then mirrored left to right if it is on the bottom)
1X03 = drill 1.016 pad 1.88: 1 0,0; 2 2.54,0; 3 5.08,0
1X06 = drill 1.016 pad 1.88: 1 0,0; 2 2.54,0; 3 5.08,0; 4 7.62,0; 5 10.16,0; 6 12.7,0
C0603 = smd 1.1 x 1: 1 -0.85,0; 2 0.85,0
E2-5 = drill 0.813 pad 1.27: + -1.016,0 | drill 0.813 pad 1.27 octagon: - 1.016,0
DO35-10 = drill 0.813 long: A 5.08,0; C -5.08,0
1X04 = drill 1.016 pad 1.88: 1 0,0; 2 2.54,0; 3 5.08,0; 4 7.62,0
1X02_LOCK = drill 1.016 pad 1.88: 1 -0.178,0; 2 2.718,0
GAS_SOCKET = drill 1.5 square: P$1 -6.151,-6.151 | drill 1.5: P$2 -8.697,0.001; P$3 -6.148,6.152; P$4 6.154,6.149; P$5 8.701,-0.003; P$6 6.152,-6.153
TO220L1 = drill 1.016 long: 1 -2.54,-3.81; 2 0,-3.81; 3 2.54,-3.81 | hole 3.302: 0,11.176
SO08 = smd 0.66 x 2.032: 1 -1.905,-3.073; 2 -0.635,-3.073; 3 0.635,-3.073; 4 1.905,-3.073; 5 1.905,3.073; 6 0.635,3.073; 7 -0.635,3.073; 8 -1.905,3.073
SO08' = smd 0.6 x 2.2: 1 -1.905,-2.6; 2 -0.635,-2.6; 3 0.635,-2.6; 4 1.905,-2.6; 5 1.905,2.6; 6 0.635,2.6; 7 -0.635,2.6; 8 -1.905,2.6
SO16W = smd 0.6 x 2.2: 1 -4.445,-4.6; 2 -3.175,-4.6; 3 -1.905,-4.6; 4 -0.635,-4.6; 5 0.635,-4.6; 6 1.905,-4.6; 7 3.175,-4.6; 8 4.445,-4.6; 9 4.445,4.6; 10 3.175,4.6; 11 1.905,4.6; 12 0.635,4.6; 13 -0.635,4.6; 14 -1.905,4.6; 15 -3.175,4.6; 16 -4.445,4.6
SO16 = smd 0.66 x 2.032: 1 -4.445,-3.073; 2 -3.175,-3.073; 3 -1.905,-3.073; 4 -0.635,-3.073; 5 0.635,-3.073; 6 1.905,-3.073; 7 3.175,-3.073; 8 4.445,-3.073; 9 4.445,3.073; 10 3.175,3.073; 11 1.905,3.073; 12 0.635,3.073; 13 -0.635,3.073; 14 -1.905,3.073; 15 -3.175,3.073; 16 -4.445,3.073
LED5MM = drill 0.813 octagon: A -1.27,0; K 1.27,0
WM-61B = drill 0.6 pad 1: 1 0,0.95; 2 0,-0.95
1X05 = drill 1.016 pad 1.88: 1 0,0; 2 2.54,0; 3 5.08,0; 4 7.62,0; 5 10.16,0
1X03_LOCK = drill 1.016 pad 1.88: 1 0,0.127; 2 2.54,-0.127; 3 5.08,0.127
SOT23-3 = smd 0.8 x 0.9: 1 -0.95,-1; 2 0.95,-1; 3 0,1.1
R0805 = smd 1.3 x 1.5: 1 -0.95,0; 2 0.95,0
3362P = drill 0.813 pad 1.676 octagon: 1 -2.54,0; 2 0,2.54; 3 2.54,0
0603-ARC = smd 0.5 x 0.65: 1 -1.2,-0.625; 2 -0.4,-0.625; 3 0.4,-0.625; 4 1.2,-0.625; 5 1.2,0.625; 6 0.4,0.625; 7 -0.4,0.625; 8 -1.2,0.625
SHORT_TOP-50 = smd 1.27 x 1.27: 1 0.635,0; 2 -0.635,0
TO92 = drill 0.813 octagon: 1 1.27,0; 2 0,1.905; 3 -1.27,0
MSOP10 = smd 0.3 x 1: 1 -1,-2.05; 2 -0.5,-2.05; 3 0,-2.05; 4 0.5,-2.05; 5 1,-2.05; 6 1,2.05; 7 0.5,2.05; 8 0,2.05; 9 -0.5,2.05; 10 -1,2.05
WEMOS-D1-MINI = drill 1: JP1.1 -11.43,9.525; JP1.2 -11.43,6.985; JP1.3 -11.43,4.445; JP1.4 -11.43,1.905; JP1.5 -11.43,-0.635; JP1.6 -11.43,-3.175; JP1.7 -11.43,-5.715; JP1.8 -11.43,-8.255; JP2.1 11.43,9.525; JP2.2 11.43,6.985; JP2.3 11.43,4.445; JP2.4 11.43,1.905; JP2.5 11.43,-0.635; JP2.6 11.43,-3.175; JP2.7 11.43,-5.715; JP2.8 11.43,-8.255
NODEMCU = drill 1 pad 1.676 long: 1 -13.97,17.78; 2 -13.97,15.24; 3 -13.97,12.7; 4 -13.97,10.16; 5 -13.97,7.62; 6 -13.97,5.08; 7 -13.97,2.54; 8 -13.97,0; 9 -13.97,-2.54; 10 -13.97,-5.08; 11 -13.97,-7.62; 12 -13.97,-10.16; 13 -13.97,-12.7; 14 -13.97,-15.24; 15 -13.97,-17.78; 16 13.97,-17.78; 17 13.97,-15.24; 18 13.97,-12.7; 19 13.97,-10.16; 20 13.97,-7.62; 21 13.97,-5.08; 22 13.97,-2.54; 23 13.97,0; 24 13.97,2.54; 25 13.97,5.08; 26 13.97,7.62; 27 13.97,10.16; 28 13.97,12.7; 29 13.97,15.24; 30 13.97,17.78
ADC-4CH-ADS1115 = drill 1 square: 1 -6.35,11.43 | drill 1: 2 -6.35,8.89; 3 -6.35,6.35; 4 -6.35,3.81; 5 -6.35,1.27; 6 -6.35,-1.27; 7 -6.35,-3.81; 8 -6.35,-6.35; 9 -6.35,-8.89; 10 -6.35,-11.43 | hole 3.1: 6.604,11.43; 6.604,-11.43

### Placement (x,y rotation side)
ADC0  21.59,25.4 90 top
ADC1  26.67,25.4 90 top
ADC2  31.75,25.4 90 top
ADC3  36.83,25.4 90 top
BME280  3.81,41.91 90 top
C1  74.93,58.42 180 bottom
C2  74.93,53.34 180 bottom
C3  31.75,41.91 0 top
C4  82.55,59.69 180 bottom
C5  74.93,55.88 180 bottom
C6  82.55,55.88 90 top
C7  52.07,43.18 0 top
C10  94.36,30.1 180 top
C11  85.09,25.4 0 top
C12  87.63,76.2 270 top
C13  85.09,76.2 270 top
C14  73.66,67.31 270 top
C15  85.09,27.94 0 top
C16  71.12,27.94 180 top
C17  71.12,25.4 180 top
C18  77.47,13.97 0 bottom
C19  90.17,13.97 0 bottom
C20  55.88,7.62 0 top
D1  82.55,50.8 180 bottom
D2  82.55,48.26 180 bottom
D3  57.15,46.99 180 top
DISPLAY  45.72,30.48 0 top
DISPLAY_2  45.72,25.4 0 top
FAN  31.75,54.61 270 top
G1  11.43,88.9 0 top
G2  31.75,88.9 0 top
G3  52.07,88.9 0 top
G4  21.59,71.12 0 top
G5  41.91,71.12 0 top
GP2Y1010AU0F  21.59,41.91 90 top
IC1  82.55,83.82 0 top
IC2  82.55,55.88 90 bottom
IC3  MCP602SN  [SO08']  57.15,68.58 270 top
IC4  MCP601SN  [SO08']  57.15,53.34 270 top
IC5  55.88,13.97 90 top
IC6  77.47,13.97 180 top
IC7  90.17,13.97 180 top
IC8  MCP601SN  [SO08']  57.15,60.96 270 top
LED1  6.35,6.35 180 top
M1  46.99,52.07 270 top
ML8511  3.81,30.48 270 top
PIR  3.81,68.58 90 top
Q1  54.1,91.44 0 bottom
Q2  50.29,95.25 0 bottom
Q3  54.1,95.25 0 bottom
Q4  50.29,91.44 0 bottom
Q6  87.63,21.59 180 top
R1  9.4,82.8 0 bottom
R2  29.97,82.8 0 bottom
R3  50.16,82.8 0 bottom
R4  50.16,86.49 0 bottom
R5  54.1,86.49 0 bottom
R6  19.43,64.9 0 bottom
R7  25.4,54.61 180 top
R8  74.93,55.88 0 top
R9  74.93,58.42 0 top
R10  21.59,6.35 0 top
R11  40.26,65.02 0 bottom
R12  82.55,76.2 90 top
R13  80.01,76.2 90 top
R14  63.5,53.34 270 top
R15  91.44,21.59 90 top
R16  63.5,60.96 90 top
R17  57.15,43.18 180 top
R18  46.99,43.18 180 top
RN1  77.47,24.13 0 top
SH1  8.26,80.14 90 top
SH2  49.15,80.01 90 top
SH3  29.21,80.01 90 top
SH4  39.37,62.23 90 top
SH5  18.54,61.47 90 top
T1  25.4,45.72 270 top
U2  77.47,29.21 270 top
U$1  82.42,60.2 180 top
U$2  82.55,69.85 180 top
U$4  83.82,27.94 270 top

### Tracks (layer width: path | path; a pad name or v marks a point on that pad's centre or on a via)
+3V3
  Top 0.203: BME280.1 2.54,43.18 2.54,55.17 3.66,56.29 3.66,68.58 PIR.1 | R8.2 75.89,55.88 75.89,58.42 R9.2 75.79,58.42 75.79,60.15 71.22,64.72 68.58,64.72 U$2.25 | U$1.JP1.8 93.88,68.48 93.88,74.78 96.52,77.42 U$2.11
  Bottom 0.203: ML8511.5 3.86,20.32 3.86,21.13 5.08,22.35 5.08,26.72 3.86,27.94 ML8511.2 3.96,27.94 5.08,29.06 5.08,30.99 3.86,32.21 3.86,41.86 BME280.1 | 68.58,87.58 62.33,81.33 | 62.33,81.33 62.28,81.28 57.61,81.28 53.24,85.65 53.24,86.46 R5.2 | 68.58,87.58 87.68,68.48 93.78,68.48 U$1.JP1.8 | 68.58,87.58 U$2.16 | 62.43,70.97 62.38,71.02 62.38,81.28 62.33,81.33 | 62.43,70.97 68.58,64.82 U$2.25 | PIR.1 9.14,68.58 14.22,63.5 51.1,63.5 58.52,70.92 62.38,70.92 62.43,70.97
+5V  (via drill 0.38)  (4 unrouted)
  Top 0.203: v74.17,28.07 74.15,28.05 74.69,27.51 76.77,27.51 78.47,29.21 U2.8 81.28,29.21 81.28,26.67
  Top 0.635: U$1.JP2.8 71.02,68.38 71.22,68.17 73.66,68.17 C14.1 73.97,68.07 83.62,58.42 83.62,55.98 83.21,55.58 | 83.21,55.58 83.11,55.58 82.6,55.07 C6.1 | v90.02,21.44 91.03,22.45 91.44,22.45 R15.2 | v81.89,13.31 81.89,10.97 IC6.16 | U$4.1 95.2,34.24 95.2,30.18 C10.1 95.4,29.87 98.65,26.62 98.65,18.39 94.69,14.43 94.69,10.97 IC7.16 | v83.72,55.07 83.21,55.58 | C20.1 53.14,7.62 51.31,9.45 IC5.16 51,9.65 50.19,9.65 49.58,10.26 v49.58,11.99 | 45.72,27.94 DISPLAY.1 | DISPLAY_2.2 45.72,27.94 | ADC0.1 ADC1.1 ADC2.1 32,25.5 38,25.5 | 40.34,27.84 45.41,27.84 45.72,27.94 | G1.P$6 17.68,82.8 17.68,86.36 20.12,88.8 G1.P$5 20.02,89.2 17.68,91.54 17.68,95 G1.P$4 | R7.2 24.38,54.66 21.64,54.66 GP2Y1010AU0F.6 | FAN.1 31.7,54.86 31.7,60.96 27.94,64.72 G4.P$6 27.84,65.02 27.84,68.58 30.28,71.02 G4.P$5 30.18,71.42 27.84,73.76 27.84,77.22 G4.P$4 28.14,77.32 32.51,77.32 37.9,82.7 G2.P$6 | IC1.3 86.87,78.23 | 86.87,78.23 87.58,77.52 87.58,77.11 C12.1 | 96.52,87.58 96.22,87.58 86.87,78.23 | G5.P$6 48.16,65.02 48.16,68.58 50.6,71.02 G5.P$5
  Bottom 0.203: v74.17,28.07 74.93,28.83 74.93,31.88 v73.53,33.27
  Bottom 0.635: 81.89,13.92 86.87,13.92 87.88,12.9 90.12,12.9 90.93,13.72 90.93,13.92 C19.1 90.93,14.22 90.02,15.14 v90.02,21.44 90.12,21.74 90.12,29.06 95.1,34.04 U$4.1 95.2,34.34 95.2,43.18 87.78,50.6 D1.A 87.58,50.8 85.65,52.73 85.65,53.95 IC2.8 85.34,54.05 84.73,54.05 v83.72,55.07 | 81.89,13.92 78.33,13.92 C18.1 78.23,13.61 71.32,6.71 55.07,6.71 49.89,11.89 v49.58,11.99 49.58,24.08 DISPLAY_2.2 | v81.89,13.31 81.89,13.92 | LED1.K 5.08,8.13 21.54,24.59 21.54,25.4 ADC0.1 | 30.28,54.76 21.74,54.76 GP2Y1010AU0F.6 | 30.28,54.76 31.7,54.76 FAN.1 | G1.P$6 17.68,82.7 22.35,82.7 27.74,77.32 G4.P$4 | G5.P$5 50.6,71.12 48.16,73.56 48.16,77.22 G5.P$4 47.75,77.32 43.69,77.32 38.3,82.7 G2.P$6 38,82.8 38,86.26 40.34,88.59 G2.P$5 40.54,88.9 42.27,90.63 | 42.27,90.63 43.89,90.63 47.45,94.18 49.28,94.18 Q2.2 49.28,94.49 49.28,96.93 49.68,97.33 67.87,97.33 83.92,81.28 83.92,81.18 IC1.3 | G2.P$4 38,95 42.16,90.83 42.27,90.63 | DISPLAY.1 45.72,31.29 47.55,33.12 47.55,33.93 30.28,51.21 30.28,54.76
  pour Top: -8.89,106.68 107.95,106.68 107.95,-6.35 -8.89,-6.35
+9V  (via drill 0.35)
  Top 0.203: v58.01,69.39 59.03,70.41 59.74,70.41 IC3.8 | v58.01,62.59 59.03,61.57 IC8.7 59.74,61.57 59.13,61.57 58.32,60.76 58.32,54.76 59.03,54.05 59.74,54.05 IC4.7 58.93,54.05 58.32,53.44 58.32,51 58.52,50.8 58.73,50.8 v60.86,48.67
  Bottom 0.203: C4.2 83.41,59.64 83.72,59.64 85.55,57.81 IC2.5 85.24,58.01 80.87,53.65 80.87,49.58 78.54,47.24 64.01,47.24 62.59,48.67 v60.86,48.67 | v58.01,62.59 v58.01,69.39
-5V  (via drill 0.35)
  Top 0.203: IC3.4 54.46,66.65 54.46,65.84 52.12,63.5 52.12,60.86 53.85,59.13 54.46,59.13 IC8.4 54.56,59.03 55.98,57.61 55.98,52.22 55.27,51.51 54.56,51.51 IC4.4 55.58,51.71 v59.03,48.26
  Bottom 0.203: 73.81,51.87 77.42,48.26 D2.C | 73.81,51.87 73.15,52.53 73.15,53.95 74.07,54.86 74.07,55.88 C5.1 | 73.81,51.87 71.32,49.38 60.15,49.38 v59.03,48.26
A0
  Top 0.203: U$1.JP1.2 93.88,53.14 95.5,53.14 96.52,52.12 U$2.1
ADC0  (via drill 0.35)
  Top 0.203: v86.06,4.37 92.05,10.36 92.05,10.87 IC7.14
  Bottom 0.203: v86.06,4.37 45.92,4.37 23.77,26.52 23.77,30.07 22.05,31.8 21.13,31.8 20.32,30.99 20.32,29.16 21.54,27.94 ADC0.2
ADC1  (via drill 0.35)
  Top 0.203: v48.67,5.69 50.7,3.66 86.67,3.66 93.27,10.26 93.27,10.87 IC7.15
  Bottom 0.203: v48.67,5.69 48.67,5.99 26.72,27.94 ADC1.2
ADC2  (via drill 0.35)
  Top 0.203: v41.76,15.24 52.93,15.24 60.45,7.72 86.87,7.72 89.51,10.36 89.51,10.87 IC7.12
  Bottom 0.203: ADC2.2 31.8,27.94 34.31,25.43 34.31,21.57 40.64,15.24 v41.76,15.24
ADC3  (via drill 0.38)
  Top 0.203: v50.8,6.35 51.62,6.35 51.92,6.04 87.17,6.04 90.12,8.99 90.12,12.65 91.4,13.93 93.05,13.93 94.61,15.49 IC7.1
  Bottom 0.203: ADC3.2 35.05,26.16 35.05,23.37 50.8,7.62 v50.8,6.35
AIN0  (via drill 0.35)
  Top 0.203: U2.4 75.49,28.75 76.1,28.75 76.4,29.06 76.4,34.75 77.01,35.36 78.94,35.36 U$4.7 81.08,35.36 85.55,35.36 86.16,34.75 86.16,34.24 87.68,32.72 87.68,25.6 86.67,24.59 85.14,24.59 84.33,25.4 C11.1 | v75.03,24.64 75.79,25.4 76.2,25.4 76.27,25.33 RN1.8
  Bottom 0.203: U$4.7 76.2,30.48 76.2,25.81 v75.03,24.64
AIN1  (via drill 0.35)
  Top 0.203: v75.01,25.65 75.01,26.04 75.08,26.11 77.01,26.11 77.01,24.79 RN1.7 | 77.42,30.68 77.42,34.24 U$4.8 | 77.42,30.68 77.42,29.46 76.2,28.25 75.49,28.25 U2.5 | C15.1 83.57,27.94 82.8,28.7 82.8,29.72 81.84,30.68 77.42,30.68
  Bottom 0.203: v75.01,25.65 75.79,26.44 75.79,32.61 U$4.8
AIN2
  Top 0.203: 77.93,26.62 77.93,24.79 RN1.6 | 77.93,26.62 79.45,28.14 U2.6 | 72.69,27.94 72.8,27.94 72.8,31.09 74.88,33.17 74.88,34.24 U$4.9 | 72.69,27.94 C16.1 | 72.69,27.94 74.02,26.62 77.93,26.62
AIN3  (via drill 0.35)
  Top 0.203: RN1.5 78.74,24.79 78.74,26.31 80.37,27.94 80.37,28.45 80.06,28.75 79.55,28.75 U2.7 79.45,28.75 78.59,28.75 76.94,27.1 74.14,27.1 73.3,27.94 73.3,30.99 76,33.68 76,34.75 75.39,35.36 73.46,35.36 U$4.10 | v72.03,26.82 72.03,25.4 C17.1
  Bottom 0.203: v72.03,26.82 72.03,33.93 U$4.10
D0
  Top 0.203: U$1.JP1.3 93.78,55.68 85.34,55.68 81.79,52.12 68.58,52.12 U$2.30
D3
  Top 0.203: U$1.JP2.5 70.92,60.76 69.6,60.76 68.58,59.74 U$2.27
D4
  Top 0.203: U$1.JP2.6 70.92,63.3 69.6,63.3 68.58,62.28 U$2.26
D5  (via drill 0.35)
  Top 0.203: v87.48,7.32 60.25,7.32 54.25,13.31 51.31,13.31 IC5.13 | U$2.23 68.58,69.8 74.88,69.8 86.36,58.32 93.78,58.32 U$1.JP1.4
  Bottom 0.203: v87.48,7.32 98.55,18.39 98.55,55.07 97.64,55.98 95.2,55.98 93.88,57.3 93.88,58.22 U$1.JP1.4
D6
  Top 0.203: U$1.JP1.5 93.78,60.86 84.43,60.86 74.98,70.31 70.61,70.31 68.58,72.34 U$2.22
D7
  Top 0.203: U$1.JP1.6 93.78,63.4 82.8,63.4 71.32,74.88 68.58,74.88 U$2.21
D8
  Top 0.203: U$1.JP1.7 93.78,65.94 80.87,65.94 69.39,77.42 68.58,77.42 U$2.20
DUST  (via drill 0.35)
  Top 0.203: v70.41,24.28 73.36,24.28 78.03,19.61 78.03,17.07 IC6.4 | v61.87,32.82 52.63,32.82 31.9,53.54 29.26,53.54 26.92,55.88 21.03,55.88 20.32,55.17 20.32,53.34 GP2Y1010AU0F.5
  Bottom 0.203: v61.87,32.82 v70.41,24.28
GND  (via drill 0.38, 0.64)
  Top 0.203: U2.3 74.42,29.21 v74.17,29.46 74.17,30.1 74.28,30.21 U2.1
  Top 0.635: 81.53,58.37 73.76,66.14 C14.2 73.66,66.45 71.53,66.45 U$1.JP2.7 70.71,66.04 69.49,67.26 68.58,67.26 U$2.24 | 81.53,58.37 82.5,57.4 82.5,56.79 C6.2 | v81.69,58.52 81.53,58.37 | 49.38,91.54 45.92,91.54 43.38,89 G3.P$2 | 49.38,91.54 v51,91.54 | U$2.14 96.52,85.04 96.22,85.04 88.7,77.52 88.7,76.3 87.88,75.49 C12.2 87.58,75.39 85.14,75.39 C13.2 84.84,75.18 83.72,74.07 81.58,74.07 80.47,75.18 80.06,75.18 R13.1 79.76,75.18 69.9,85.04 68.58,85.04 U$2.17 68.28,85.14 51.71,85.14 49.38,87.48 49.38,91.54 | 55.47,60.35 54.56,60.35 IC8.3 54.25,60.45 53.54,60.45 52.83,61.16 52.83,63.3 53.24,63.7 53.75,63.7 56.19,66.14 56.19,67.26 55.58,67.87 54.56,67.87 IC3.3 54.25,67.77 53.44,67.77 52.83,67.16 v52.83,67.06 | 55.47,60.35 57.1,61.98 57.1,64.01 59.74,66.65 IC3.5 | v52.43,52.63 52.83,52.63 | 52.83,52.63 54.46,52.63 IC4.3 | T1.1 25.4,44.5 21.64,44.5 GP2Y1010AU0F.2 21.54,44.81 20.12,46.23 20.12,47.65 21.54,49.07 21.54,49.48 GP2Y1010AU0F.4 | C3.- 31.8,42.88 31.8,51.82 FAN.2 | 55.47,60.35 57.61,58.22 57.61,50.8 59.23,49.17 59.44,49.17 59.94,48.67 59.94,47.85 59.44,47.35 56.49,47.35 52.83,51 52.83,52.63 | U$4.2 93.47,33.53 93.47,30.18 C10.2 | C11.2 85.95,25.4 86.97,26.42 86.97,27.23 86.26,27.94 C15.2 85.85,28.25 85.85,33.53 U$4.5 | 86.67,17.37 86.67,22.55 Q6.2 | 86.67,17.37 IC7.7 86.97,16.76 v86.97,15.34 | IC7.8 85.75,17.07 86.16,17.07 86.36,17.27 86.67,17.37 | v58.12,7.62 C20.2 | 58.83,17.68 59.54,18.39 60.45,18.39 IC5.8 60.76,18.49 67.67,18.49 69.19,20.02 69.49,20.12 | 58.83,17.68 58.83,12.8 59.44,12.19 60.25,12.19 IC5.3 60.55,11.99 60.55,11.07 IC5.2 60.55,10.77 60.55,9.55 IC5.1 60.66,9.25 v60.66,8.53
  Top 0.635: C16.2 70.31,27.94 70.31,25.4 C17.2 70,25.3 69.49,24.79 69.49,20.12 | 69.49,20.12 72.54,17.07 72.95,17.07 IC6.8 73.36,17.07 74.27,17.07 IC6.7 | R10.2 R10.1 | ADC0.3 ADC1.3 ADC2.3 | 58.83,17.68 58.52,17.78 54.97,17.78 52.43,20.32 v45.72,20.32
  Bottom 0.203: U$2.2 92.71,54.61
  Bottom 0.635: G1.P$2 2.74,88.9 4.57,88.9 10.26,83.21 10.26,82.8 R1.1 10.26,82.5 10.26,73.97 10.16,73.66 | 10.16,73.66 PIR.3 | 10.16,73.66 12.6,71.22 G4.P$2 12.9,71.12 14.43,71.12 20.32,65.23 20.32,64.92 R6.1 20.62,65.33 22.15,65.33 30.28,73.46 30.68,73.46 30.99,73.56 | G2.P$2 23.06,88.9 25.09,88.9 30.89,83.11 30.89,82.8 R2.1 30.99,82.5 30.99,73.56 | 30.99,73.56 33.12,71.42 G5.P$2 33.22,71.12 35.36,71.12 41.15,65.33 41.15,65.02 R11.1 41.45,65.43 46.13,65.43 50.09,69.39 51.31,69.39 | C5.2 78.03,55.88 78.64,56.49 79.45,56.49 IC2.3 79.76,56.59 80.37,56.59 81.69,57.91 v81.69,58.52 81.69,59.64 C4.1 | 47.95,90.42 44.91,90.42 43.38,88.9 G3.P$2 | 47.95,90.42 49.28,90.42 Q4.2 | v51,91.54 51.82,91.54 52.83,90.53 53.14,90.53 Q1.2 | 47.95,90.42 47.95,85.55 48.36,85.14 49.07,85.14 51.1,83.11 51.1,82.8 R3.1 51.21,82.5 51.21,72.95 52.32,71.83 52.32,70.41 51.31,69.39 | U$2.10 96.52,74.98 96.22,74.98 94.28,76.91 94.28,83.11 96.22,85.04 96.52,85.04 U$2.14 | U$2.24 68.58,67.36 68.28,67.36 66.34,69.29 66.34,83.11 68.28,85.04 68.58,85.04 U$2.17 | ML8511.3 3.76,25.4 3.76,25.91 2.34,27.33 2.34,42.98 BME280.2 4.06,44.4 21.54,44.4 GP2Y1010AU0F.2 | v52.43,52.63 48.46,52.63 47.95,52.12 M1.1 47.65,52.22 47.45,52.22 46.43,53.24 33.12,53.24 31.8,51.92 FAN.2 | T1.1 25.4,44.4 29.97,44.4 32.41,41.96 32.72,41.96 C3.- 32.31,41.66 32.31,31.19 31.9,30.79 ADC2.3 31.8,30.48 34.24,28.04 | U$4.2 92.66,34.34 91.95,34.34 90.63,35.66 86.46,35.66 U$4.5 85.14,34.04 85.14,15.04 | 60.66,7.62 70.31,7.62 76.61,13.92 C18.2 76.71,14.22 77.52,15.04 85.14,15.04 | 60.66,7.62 v58.12,7.62 | 86.97,15.04 87.99,14.02 89.31,14.02 C19.2
  Bottom 0.635: 85.14,15.04 86.97,15.04 | v86.97,15.34 86.97,15.04 | 45.72,27.94 DISPLAY_2.1 | DISPLAY.2 45.72,27.94 | R10.2 21.64,8.94 21.64,23.37 23.06,24.79 23.06,29.06 21.64,30.48 ADC0.3 | 45.41,28.04 45.72,27.94 | v60.66,8.53 60.66,7.62 | v52.83,67.06 51.41,68.48 51.41,69.09 51.31,69.39
  pour Bottom: -8.89,106.68 107.95,106.68 107.95,-6.35 -8.89,-6.35
GPIOEXT0  (via drill 0.35)
  Top 0.203: v52.63,72.85 52.63,68.48 50.29,66.14 50.29,49.89 45.01,44.6 45.01,42.37 53.85,33.53 v55.37,33.53 | v52.12,19.3 51.31,18.49 IC5.9
  Bottom 0.203: v52.63,72.85 52.12,73.36 52.12,88.19 51.31,89 51.31,90.42 Q4.1 | v55.37,33.53 55.37,22.55 v52.12,19.3
GPIOEXT1
  Top 0.203: IC5.10 51.21,17.17 28.04,17.17 5.08,40.13 5.08,70 3.96,71.12 PIR.2
GPIOEXT2  (via drill 0.35)
  Top 0.203: v19.91,24.28 28.25,15.95 51.21,15.95 IC5.11
  Bottom 0.203: v19.91,24.28 19.91,38.41 24.38,42.88 24.38,44.81 25.3,45.72 T1.2
LIGHT  (via drill 0.35)
  Top 0.203: v76.91,18.69 76.91,17.07 IC6.5 | v57.91,8.64 58.12,8.64 58.83,7.92 58.83,7.32 57.91,6.4 52.07,6.4 50.83,7.64 49.55,7.64 48.31,8.89 27.94,8.89 25.4,6.35 R10.3
  Bottom 0.203: v76.91,18.69 72.95,18.69 63.5,9.25 58.52,9.25 v57.91,8.64 | R10.3 22.96,7.52 18.59,7.52 17.48,6.4 7.62,6.4 LED1.A
MQ3  (via drill 0.35)
  Top 0.203: v39.93,13.41 29.77,13.41 2.13,41.05 2.13,73.97 7.62,79.45 8.23,79.45 SH1.2 | v77.42,9.25 77.42,9.65 78.03,10.26 78.03,10.87 IC6.13
  Bottom 0.203: v39.93,13.41 48.36,4.98 73.15,4.98 v77.42,9.25
MQ4  (via drill 0.35)
  Top 0.203: v38.86,26.42 38.86,31.5 37.29,33.07 28.6,33.07 19.41,42.27 19.41,47.75 19.51,47.85 19.51,71.12 27.74,79.35 29.16,79.35 SH3.2 | v78.84,9.25 78.84,10.36 IC6.14
  Bottom 0.203: v38.86,26.42 38.86,21.69 54.56,5.99 72.14,5.99 76.1,9.96 78.13,9.96 v78.84,9.25
MQ7  (via drill 0.35)
  Top 0.203: v74.17,71.02 71.63,73.56 67.46,73.56 61.67,79.35 49.17,79.35 SH2.2 | v82.91,10.06 82.4,9.55 81.48,9.55 80.67,10.36 80.67,10.87 IC6.15
  Bottom 0.203: v74.17,71.02 92.76,52.43 92.76,46.53 96.32,42.98 96.32,26.21 92.35,22.25 92.35,12.8 89.61,10.06 v82.91,10.06
MQ8  (via drill 0.35)
  Top 0.203: v26.92,32 18.59,40.34 18.59,60.76 SH5.2 | v76.4,9.25 76.4,10.46 IC6.12
  Bottom 0.203: v26.92,32 30.48,28.45 30.48,24.89 49.78,5.59 72.75,5.59 v76.4,9.25
MQ135
  Top 0.203: IC6.1 82.04,17.17 82.55,17.17 85.08,14.64 92.98,14.64 94.03,15.7 94.03,18.16 94.46,18.59 97.94,18.59 97.94,22.45 89.1,31.29 89.1,34.34 87.27,36.17 81.38,36.17 65.23,52.32 65.23,67.46 59.13,73.56 51,73.56 49.17,71.73 49.17,70.92 39.93,61.67 39.42,61.67 SH4.2
N$1  (via drill 0.35)
  Top 0.203: v77.11,54.97 v77.11,56.79
  Bottom 0.203: 77.11,55.07 79.35,55.07 79.45,55.17 IC2.2 | 77.11,55.07 75.89,55.07 74.17,53.34 C2.1 | v77.11,56.79 75.79,56.79 74.17,58.42 C1.1 | 77.11,55.07 v77.11,54.97
N$2
  Top 0.203: 28.8,45.67 30.68,43.79 30.68,41.96 C3.+ | 28.8,45.67 26.42,48.06 26.42,54.56 R7.1 | 28.8,45.67 25.09,41.96 21.64,41.96 GP2Y1010AU0F.1
N$3
  Top 0.203: T1.3 25.4,47.04 21.64,47.04 GP2Y1010AU0F.3
N$4
  Bottom 0.203: Q1.3 54.15,92.56 54.15,93.37 54.97,94.18 Q3.1 54.76,94.08 53.75,95.1 50.8,95.1 50.49,94.79 50.49,94.08 49.58,93.17 49.58,91.95 50.09,91.44 50.09,89.61 51.1,88.59 51.1,86.56 R4.1
N$5
  Bottom 0.203: Q2.1 51.21,94.18 50.29,93.27 Q4.3 50.29,92.46 52.83,92.46 54.76,90.53 54.97,90.53 Q1.1 55.07,90.42 55.07,86.56 R5.1
N$6
  Top 0.635: SH1.1 7.21,80.77 5.28,82.7 G1.P$1 5.28,83.01 5.28,95 G1.P$3
  Bottom 0.635: R1.2 5.28,82.8 G1.P$1
N$7
  Bottom 0.203: C1.2 78.84,58.42 IC2.4
N$8
  Top 0.203: R14.1 R16.1 63.5,60.05 61.16,62.38 61.16,67.16 60.45,67.87 59.84,67.87 IC3.6 59.74,67.87 59.03,67.87 56.39,65.23 56.39,62.79 55.27,61.67 54.56,61.67 IC8.2
N$9
  Top 0.203: IC1.1 80.06,79.96 80.06,77.22 R13.2 80.16,77.22 82.09,75.29 82.5,75.29 R12.1
N$10
  Top 0.203: D2.A 80.06,48.26 77.52,50.8 D1.C
  Bottom 0.203: C2.2 75.79,53.34 75.79,52.43 77.42,50.8 D1.C
N$11
  Top 0.203: R17.1 58.42,43.18 D3.C 62.28,47.04 62.28,52.43 | 62.28,52.43 60.05,52.43 59.84,52.63 IC4.6 | 62.28,52.43 63.5,52.43 | 63.5,52.43 64.62,53.54 64.62,67.46 60.96,71.12 58.52,71.12 57.91,70.51 54.56,70.51 IC3.1 | 63.5,52.43 R14.2
N$12
  Bottom 0.635: Q2.3 50.29,96.42 54.05,96.42 Q3.3 54.36,96.22 57.1,96.22 58.22,95.1 G3.P$4 58.42,94.79 58.42,91.44 60.66,89.2 G3.P$5 60.76,88.8 58.32,86.36 58.32,82.8 G3.P$6
N$13
  Top 0.203: R18.1 C7.1
N$14
  Top 0.203: R17.2 C7.2 52.83,43.18 52.83,46.23 D3.A 51.71,47.35 51.71,52.93 52.68,53.9 | 52.68,53.9 52.73,53.95 54.46,53.95 IC4.2 | 52.68,53.9 51.71,54.86 51.71,66.95 53.95,69.19 54.46,69.19 IC3.2
N$15  (via drill 0.35)
  Top 0.203: v46.13,44.7 46.13,43.18 R18.2
  Bottom 0.203: v46.13,44.7 46.13,52.02 M1.2
N$16
  Top 0.635: SH2.1 49.07,80.67 47.95,80.67 45.92,82.7 G3.P$1 45.62,82.8 44.2,82.8 38.71,88.29 38.71,89.51 44.2,95 45.82,95 G3.P$3
  Bottom 0.635: R3.2 45.92,82.8 G3.P$1
N$17
  Top 0.635: SH3.1 29.16,80.67 27.64,80.67 25.6,82.7 G2.P$1 25.6,83.01 25.6,95 G2.P$3
  Bottom 0.635: R2.2 25.6,82.8 G2.P$1
N$18  (via drill 0.35)
  Top 0.203: v80.97,12.5 76.61,12.5 75.59,11.48 75.59,10.97 IC6.11 | v86.97,12.5 87.17,12.5 88.19,11.48 88.19,10.97 IC7.11 88.19,10.87 88.19,10.26 86.06,8.13 73.36,8.13 68.17,13.31 60.55,13.31 IC5.4
  Bottom 0.203: v86.97,12.5 v80.97,12.5
N$19
  Top 0.203: IC7.10 86.97,10.87 86.97,10.36 85.14,8.53 76.1,8.53 74.37,10.26 74.37,10.87 IC6.10 74.37,10.16 73.76,9.55 72.54,9.55 67.56,14.53 60.55,14.53 IC5.5
N$20
  Top 0.203: IC5.6 60.55,15.85 66.85,15.85 71.73,10.97 72.95,10.97 IC6.9 73.05,10.97 73.05,11.48 75.59,14.02 82.19,14.02 85.24,10.97 85.65,10.97 IC7.9
N$21
  Top 0.635: SH4.1 39.32,62.89 37.8,62.89 35.76,64.92 G5.P$1 35.76,65.23 35.76,77.22 G5.P$3
  Bottom 0.635: R11.2 35.76,65.02 G5.P$1
N$22
  Top 0.635: SH5.1 18.49,62.18 18.19,62.18 15.44,64.92 G4.P$1 15.44,65.23 15.44,77.22 G4.P$3
  Bottom 0.635: R6.2 18.39,64.92 15.44,64.92 G4.P$1
N$32  (via drill 0.35)
  Top 0.203: v81.69,19.71 85.34,23.37 87.27,23.37 87.99,22.66 88.49,22.66 Q6.1 | v76.91,19.71 75.59,18.39 75.59,17.07 IC6.6 75.49,16.97 75.49,16.46 74.68,15.65 72.64,15.65 71.22,17.07 60.55,17.07 IC5.7
  Bottom 0.203: v76.91,19.71 v81.69,19.71
N$33
  Top 0.203: IC7.6 88.19,17.07 87.68,17.58 87.68,20.42 Q6.3 87.78,20.42 87.99,20.62 91.44,20.62 R15.1
N$34
  Top 0.203: RN1.1 76.3,23.47 76.3,21.95 79.35,18.9 79.35,17.07 IC6.3
N$35
  Top 0.203: RN1.3 77.93,23.47 77.93,23.16 78.23,22.86 84.23,22.86 85.14,23.77 92.05,23.77 92.56,23.27 92.56,17.48 92.15,17.07 IC7.3
NONE
  cutout Top: 28.26,6.99 46.04,6.99 46.04,2.22 28.26,2.22
RST
  Top 0.203: U$1.JP1.1 93.88,50.7 97.64,50.7 98.55,51.61 98.55,80.47 96.52,82.5 U$2.13
RX
  Bottom 0.203: U$1.JP2.2 71.02,53.24 71.02,54.25 72.14,55.37 72.14,76.4 68.58,79.96 U$2.19
SCL  (via drill 0.35)
  Top 0.203: v86.06,26.82 83.82,26.82 82.4,28.25 82.4,29.36 81.58,30.18 79.55,30.18 U2.10 | R8.1 71.12,55.88 U$1.JP2.3 69.9,54.66 68.58,54.66 U$2.29 | v53.03,12.09 51.31,12.09 IC5.14 | DISPLAY_2.4 50.8,27.94 DISPLAY.3 47.75,33.53 v46.63,33.53
  Bottom 0.203: v86.06,26.82 86.06,30.18 U$4.3 90.22,34.24 91.14,34.24 92.15,33.22 93.17,33.22 93.78,33.83 93.78,34.75 92.15,36.37 54.66,36.37 | v53.03,12.09 53.03,17.37 51.41,19 51.41,23.47 DISPLAY_2.4 54.66,26.72 54.66,36.37 | v46.63,33.53 31.9,48.26 21.03,48.26 19.81,47.04 3.86,47.04 BME280.3 | 54.66,36.37 54.66,44.91 64.31,54.56 68.58,54.56 U$2.29
SDA  (via drill 0.35)
  Top 0.203: v53.03,11.07 52.83,10.87 51.31,10.87 IC5.15 | DISPLAY.4 60.55,30.48 65.84,35.76 85.75,35.76 87.17,34.34 87.58,34.34 U$4.4 88.09,33.83 88.09,25.4 86.87,24.18 83.92,24.18 83.31,24.79 83.31,26.52 81.88,27.95 81.88,29.3 81.47,29.71 U2.9 | R9.1 71.12,58.42 U$1.JP2.4 69.9,57.2 68.58,57.2 U$2.28
  Bottom 0.203: v53.03,11.07 50.8,13.31 DISPLAY_2.3 53.34,27.94 DISPLAY.4 53.34,46.23 53.75,46.63 53.75,57.1 | 53.75,57.1 68.58,57.1 U$2.28 | 53.75,57.1 22.25,57.1 14.73,49.58 3.86,49.58 BME280.4
SOUND  (via drill 0.35)
  Top 0.203: R16.2 v63.5,63.2 63.5,66.04 60.35,69.19 59.84,69.19 IC3.7 | v91.34,12.8 90.83,12.29 90.83,10.97 IC7.13 | v91.95,29.57 91.95,33.53 91.24,34.24 91.24,34.75 78.74,47.24 70.92,47.24 65.94,52.22 v65.94,60.76 | v61.47,61.06 60.76,60.35 59.84,60.35 IC8.6
  Bottom 0.203: v91.34,12.8 91.95,13.41 v91.95,29.57 | v65.94,60.76 v63.5,63.2 63.5,63.09 v61.47,61.06
TX
  Bottom 0.203: U$1.JP2.1 71.02,50.7 71.02,51.71 72.54,53.24 72.54,78.54 68.58,82.5 U$2.18
UV  (via drill 0.35)
  Top 0.203: v68.48,15.24 79.35,15.24 80.57,16.46 80.57,16.97 IC6.2 | v53.95,12.6 53.54,12.6 53.34,12.8 52.63,12.8 52.53,12.7 14.02,12.7 3.86,22.86 ML8511.4
  Bottom 0.203: v68.48,15.24 56.59,15.24 v53.95,12.6
VCC  (via drill 0.38)
  Top 0.635: C13.1 85.04,77.11 82.6,77.11 R12.2 82.6,77.42 82.6,79.96 IC1.2 82.4,80.26 72.03,90.63 52.12,90.63 | 52.12,90.63 52.12,89.71 v50.29,87.88 | 52.12,90.63 v52.12,93.17
  Bottom 0.635: v52.12,93.17 53.14,94.18 Q3.2 | v50.29,87.88 49.28,86.87 49.28,86.56 R4.2

### Text on the board
Top: ESP8266 SENSOR BOARD / V1.0, 27.12.2018 / Lukas Schröer
tStop: ESP8266 SENSOR BOARD / V1.0, 27.12.2018 / Lukas Schröer